# Altium project WiSN.PrjPCB
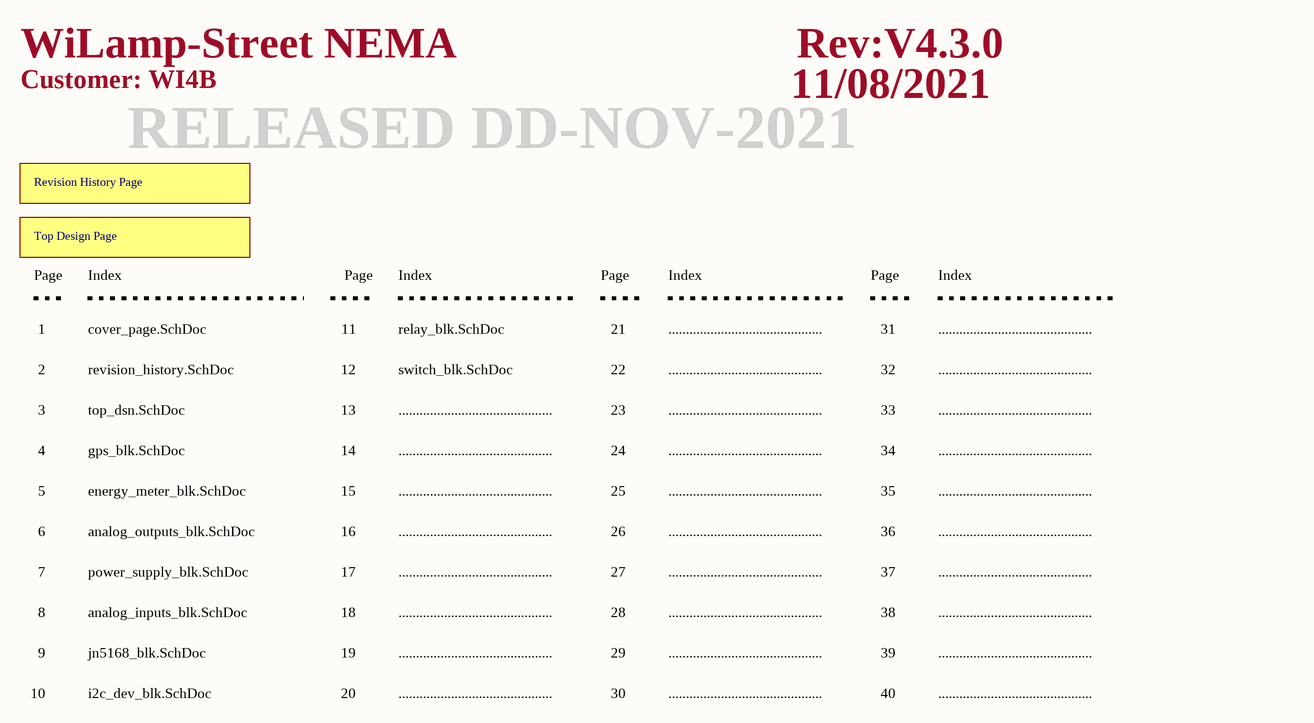
[diagram p0: cover_page.SchDoc]
12 sheets, 132 parts. Net scope: hierarchical (ports join the sheet entries above them; power ports are global).
Board file: WiSN.PcbDoc
Sheets:
  cover_page.SchDoc
    Top Design Page = top_dsn.SchDoc
      Power Supply Module (4) = power_supply_blk.SchDoc
      Energy Meter Module (5) = energy_meter_blk.SchDoc
      Analog Input Module (6) = analog_inputs_blk.SchDoc
      Analog Output Module (9) = analog_outputs_blk.SchDoc
      Core Module = jn5168_blk.SchDoc
      Relay = relay_blk.SchDoc
      i2c Devices = i2c_dev_blk.SchDoc
      GPS = gps_blk.SchDoc
      switch_blk = switch_blk.SchDoc
    Revision History Page = revision_history.SchDoc

## Sheet cover_page.SchDoc
size A4; Date: 1/11/16; Engineer: JBayalas; DocumentNumber: 1; Revision: V4.3.0; SheetNumber: 1; SheetTotal: 12

### Sub-sheets
Revision History Page = revision_history.SchDoc: no entries
Top Design Page = top_dsn.SchDoc: no entries

### Notes on the sheet
- WiLamp-Street NEMA
- Rev:V4.3.0
- Customer: WI4B
- 11/08/2021
- RELEASED DD-NOV-2021
- Page
- Index
- 1
- cover_page.SchDoc
- 11
- relay_blk.SchDoc
- 21
- ............................................
- 31
- 2
- 3
- revision_history.SchDoc
- top_dsn.SchDoc
- 12
- 13
- switch_blk.SchDoc
- 22
- 23
- 32
- 33
- 4
- gps_blk.SchDoc
- 14
- 24
- 34
- 5
- 6
- analog_outputs_blk.SchDoc
- energy_meter_blk.SchDoc
- 15
- 16
- 25
- 26
- 35
- 36
- 7
- 8
- power_supply_blk.SchDoc
- analog_inputs_blk.SchDoc
- 17
- 18
- 27
- 28
- 37
- 38
- 9
- jn5168_blk.SchDoc
- 19
- 29
- 39
- 10
- i2c_dev_blk.SchDoc
- 20
- 30
- 40
- Title:
- Sheet:
- Date:
- of
- Project:
- Revision:
- Engineer:
- Wi4B S.r.l

## Sheet top_dsn.SchDoc
size A4; Date: 1/11/16; Engineer: JBayalas; DocumentNumber: 3; Revision: V4.3.0; SheetNumber: 3; SheetTotal: 12
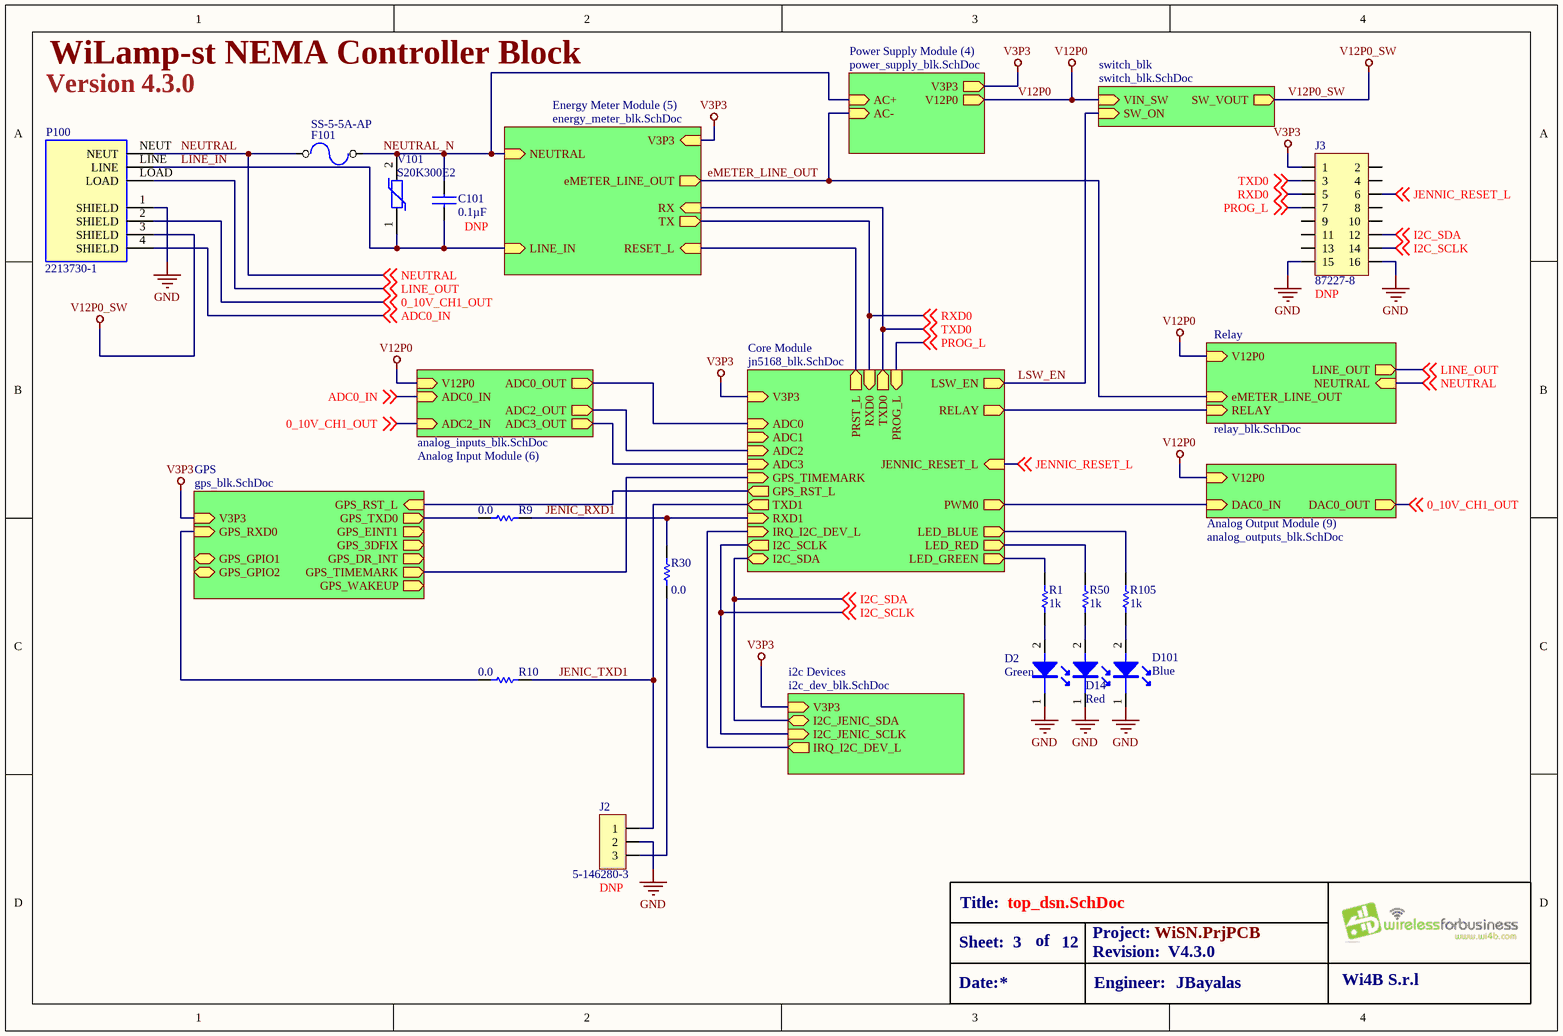
[diagram p1: top_dsn.SchDoc]

### Parts
C101  value 0.1µF  [R46KF310000P1M]  (hidden comment: R46KF310000P1M)
D2  value Green  [LED0402(GREEN)]  (hidden comment: XZVGR68W-3)
D14  value Red  [LED0402(RED)]  (hidden comment: VLMS1500-GS08)
D101  value Blue  [LED0402(BLUE)]  (hidden comment: VLMB1500-GS08)
F101  SS-5-5A-AP  [SS-5-5A-AP]
J2  5-146280-3  [5-146280-3]
J3  87227-8  [87227-8]
P100  2213730-1  [LIGHTCTRL_2213730-1_2213730-1(Primary)]
R1  value 1k  [R0402]  (hidden comment: ERJ-2RKF1001X)
R9  value 0.0  [R0603]  (hidden comment: CRCW06030000Z0EA)
R10  value 0.0  [R0603]  (hidden comment: CRCW06030000Z0EA)
R30  value 0.0  [R0603]  (hidden comment: CRCW06030000Z0EA)
R50  value 1k  [R0402]  (hidden comment: ERJ-2RKF1001X)
R105  value 1k  [R0402]  (hidden comment: ERJ-2RKF1001X)
V101  S20K300E2  [S20K300E2]

### Sub-sheets
Analog Input Module (6) = analog_inputs_blk.SchDoc: ADC0_OUT (out), ADC2_IN (in), ADC2_OUT (out), ADC0_IN (in), V12P0 (in), ADC3_OUT (out)
Analog Output Module (9) = analog_outputs_blk.SchDoc: DAC0_OUT (out), DAC0_IN (in), V12P0 (in)
Core Module = jn5168_blk.SchDoc: V3P3 (in), ADC0 (in), PROG_L (in), ADC1 (in), ADC2 (in), TXD0 (out), RXD0 (in), TXD1 (out), RXD1 (in), PWM0 (out), LED_BLUE (out), RELAY (out), PRST_L (out), I2C_SDA (bidir), I2C_SCLK (out), ADC3 (in), LED_RED (out), IRQ_I2C_DEV_L (in), LED_GREEN (out), GPS_RST_L (out), LSW_EN (out), GPS_TIMEMARK (in), JENNIC_RESET_L (in)
Energy Meter Module (5) = energy_meter_blk.SchDoc: LINE_IN (in), NEUTRAL (in), eMETER_LINE_OUT (out), TX (out), RX (in), RESET_L (in), V3P3 (in)
GPS = gps_blk.SchDoc: V3P3 (in), GPS_TXD0 (out), GPS_RXD0 (in), GPS_RST_L (in), GPS_GPIO1 (bidir), GPS_GPIO2 (bidir), GPS_EINT1 (out), GPS_3DFIX (out), GPS_DR_INT (out), GPS_TIMEMARK (out), GPS_WAKEUP (out)
i2c Devices = i2c_dev_blk.SchDoc: I2C_JENIC_SDA (bidir), I2C_JENIC_SCLK (in), V3P3 (in), IRQ_I2C_DEV_L (out)
Power Supply Module (4) = power_supply_blk.SchDoc: V12P0 (out), AC+ (in), AC- (in), V3P3 (out)
Relay = relay_blk.SchDoc: V12P0 (in), RELAY (in), eMETER_LINE_OUT (in), LINE_OUT (out), NEUTRAL (in)
switch_blk = switch_blk.SchDoc: VIN_SW (in), SW_ON (in), SW_VOUT (out)

### Nets
GND: D2.1 D14.1 D101.1 J2.2 J3.15 J3.16 P100.1(SHIELD)
LINE_IN: C101.2 P100.LINE V101.1 ; sheet Energy Meter Module (5)/LINE_IN
V3P3: J3.1 ; sheet Power Supply Module (4)/V3P3, sheet Energy Meter Module (5)/V3P3, sheet Core Module/V3P3, sheet i2c Devices/V3P3, sheet GPS/V3P3
V12P0: sheet Power Supply Module (4)/V12P0, sheet Analog Input Module (6)/V12P0, sheet Analog Output Module (9)/V12P0, sheet Relay/V12P0, sheet switch_blk/VIN_SW
V12P0_SW: P100.3(SHIELD) ; sheet switch_blk/SW_VOUT
0_10V_CH1_OUT: P100.2(SHIELD) ; off-sheet 0_10V_CH1_OUT, sheet Analog Input Module (6)/ADC2_IN, sheet Analog Output Module (9)/DAC0_OUT
ADC0_IN: P100.4(SHIELD) ; off-sheet ADC0_IN, sheet Analog Input Module (6)/ADC0_IN
eMETER_LINE_OUT: sheet Power Supply Module (4)/AC-, sheet Energy Meter Module (5)/eMETER_LINE_OUT, sheet Relay/eMETER_LINE_OUT
GPS_RST_L: sheet Core Module/GPS_RST_L, sheet GPS/GPS_RST_L
GPS_RXD0: R10.2 ; sheet GPS/GPS_RXD0
GPS_TIMEMARK: sheet Core Module/GPS_TIMEMARK, sheet GPS/GPS_TIMEMARK
GPS_TXD0: R9.2 ; sheet GPS/GPS_TXD0
I2C_SCLK: J3.14 ; off-sheet I2C_SCLK, sheet Core Module/I2C_SCLK, sheet i2c Devices/I2C_JENIC_SCLK  [project net I2C_JENIC_SCLK]
I2C_SDA: J3.12 ; off-sheet I2C_SDA, sheet Core Module/I2C_SDA, sheet i2c Devices/I2C_JENIC_SDA  [project net I2C_JENIC_SDA]
IRQ_I2C_DEV_L: sheet Core Module/IRQ_I2C_DEV_L, sheet i2c Devices/IRQ_I2C_DEV_L
JENIC_RXD1: R9.1 R30.2 ; sheet Core Module/RXD1
JENIC_TXD1: J2.1 R10.1 ; sheet Core Module/TXD1
JENNIC_RESET_L: J3.6 ; off-sheet JENNIC_RESET_L, sheet Core Module/JENNIC_RESET_L
LINE_OUT: P100.LOAD ; off-sheet LINE_OUT, sheet Relay/LINE_OUT
LSW_EN: sheet Core Module/LSW_EN, sheet switch_blk/SW_ON
NEUTRAL: F101.1 P100.NEUT ; off-sheet NEUTRAL, sheet Relay/NEUTRAL
NEUTRAL_N: C101.1 F101.2 V101.2 ; sheet Power Supply Module (4)/AC+, sheet Energy Meter Module (5)/NEUTRAL
PROG_L: J3.7 ; off-sheet PROG_L, sheet Core Module/PROG_L
RXD0: J3.5 ; off-sheet RXD0, sheet Energy Meter Module (5)/TX, sheet Core Module/RXD0
TXD0: J3.3 ; off-sheet TXD0, sheet Energy Meter Module (5)/RX, sheet Core Module/TXD0
NetC28_1: sheet Analog Input Module (6)/ADC3_OUT, sheet Core Module/ADC3
NetC601_1: sheet Analog Input Module (6)/ADC0_OUT, sheet Core Module/ADC0
NetC603_1: sheet Analog Input Module (6)/ADC2_OUT, sheet Core Module/ADC2
NetD2_2: D2.2 R1.1
NetD14_2: D14.2 R50.1
NetD101_2: D101.2 R105.1
NetJ2_3: J2.3 R30.1
NetQ4_1: sheet Core Module/RELAY, sheet Relay/RELAY
NetR1_2: R1.2 ; sheet Core Module/LED_GREEN
NetR50_2: R50.2 ; sheet Core Module/LED_RED
NetR105_2: R105.2 ; sheet Core Module/LED_BLUE
NetR108_1: sheet Analog Output Module (9)/DAC0_IN, sheet Core Module/PWM0
NetU1_2: sheet Energy Meter Module (5)/RESET_L, sheet Core Module/PRST_L

Not connected (* = marked no-connect by the designer): J3 2 4 8 9 10 11 13

### Notes on the sheet
- Version 4.3.0
- WiLamp-st NEMA Controller Block
- Title:
- Sheet:
- Date:
- of
- Project:
- Revision:
- Engineer:
- Wi4B S.r.l

### Library data of the parts
C101 = R46KF310000P1M: CAP FILM 0.1UF 20% 560VDC RADIAL; MFT: Kemet; TYPE: Through Hole; FUNCTION: Top; MPN: R46KF310000P1M; RATING: 560VDC; DNP: DNP
D2 = XZVGR68W-3: LED GREEN CLEAR 0402 SMD; MFT: SunLED; FUNCTION: Top; MPN: XZVGR68W-3; TYPE: SMD; LOAD: *; RATING: *; APN: *
D14 = VLMS1500-GS08: LED RED 0402 SMD; ALT MPN1: YLS0402/R/21/05 C; MFT: Vishay Semiconductor Opto Division; ALT MFT1: Y.Lin Elect.; FUNCTION: Top; MPN: VLMS1500-GS08; TYPE: SMD; RATING: *; LOAD: *; ALT DESC1: *
D101 = VLMB1500-GS08: LED BLUE 0402 SMD; ALT MPN1: YLS0402/B/21/05 C; MFT: Vishay Semiconductor Opto Division; ALT MFT1: Y.Lin Elect; FUNCTION: Top; MPN: VLMB1500-GS08; TYPE: SMD; RATING: *; LOAD: *; ALT DESC1: *
F101 = SS-5-5A-AP: FUSE BOARD MOUNT 5A 250VAC RAD; MFT: Eaton Bussmann; TYPE: Through-Hole; FUNCTION: Top; VALUE: 5A; MPN: SS-5-5A-AP
J2 = 5-146280-3: CONN HEADR BRKWAY .100 3POS STR; MFT: TE Connectivity AMP Connectors; FUNCTION: Top; TYPE: TH; RATING: *; DNP: DNP; VALUE: 5-146280-3; MPN: 5-146280-3
J3 = 87227-8: CONN HEADER VERT .100 16POS 15AU; MFT: TE Connectivity AMP Connectors; FUNCTION: Top; VALUE: 87227-8; TYPE: SMD; RATING: *; DNP: DNP; MPN: 87227-8
P100 = 2213730-1: MFT: TE Connectivity; FUNCTION: Top; TYPE: TH; LOAD: *; RATING: *; VALUE: 2213730-1; MPN: 2213730-1
R1 R50 R105 = ERJ-2RKF1001X: RES SMD 1K OHM 1% 1/10W 0402; MFT: Panasonic Electronic Components; RATING: 0.1W, 1/10W; FUNCTION: Top; MPN: ERJ-2RKF1001X; TYPE: Surface Mount
R9 R10 R30 = CRCW06030000Z0EA: RES SMD 0.0OHM JUMPER 1/10W 0603; MFT: Vishay Dale; RATING: 0.1W, 1/10W; FUNCTION: Top; MPN: CRCW06030000Z0EA; DNP: *; TYPE: Surface Mount
V101 = S20K300E2: VARISTOR 470V 10KA DISC 20MM; ALT MPN1: SVR20D471KA99BH; MFT: EPCOS (TDK); ALT DESC1: 20D 470V 10KVA/5KVA 6000A(8/20us) Bulk SVR20D471KA99BH; ALT MFT1: Fenghua; FUNCTION: Top; VALUE: S20K300E2; TYPE: SMD; RATING: 470V 10KA; MPN: S20K300E2; LOAD: *; APN: *

## Sheet power_supply_blk.SchDoc
size A4; Date: 1/11/2016; Engineer: JBayalas; DocumentNumber: 7; Revision: V4.3.0; SheetNumber: 7; SheetTotal: 12
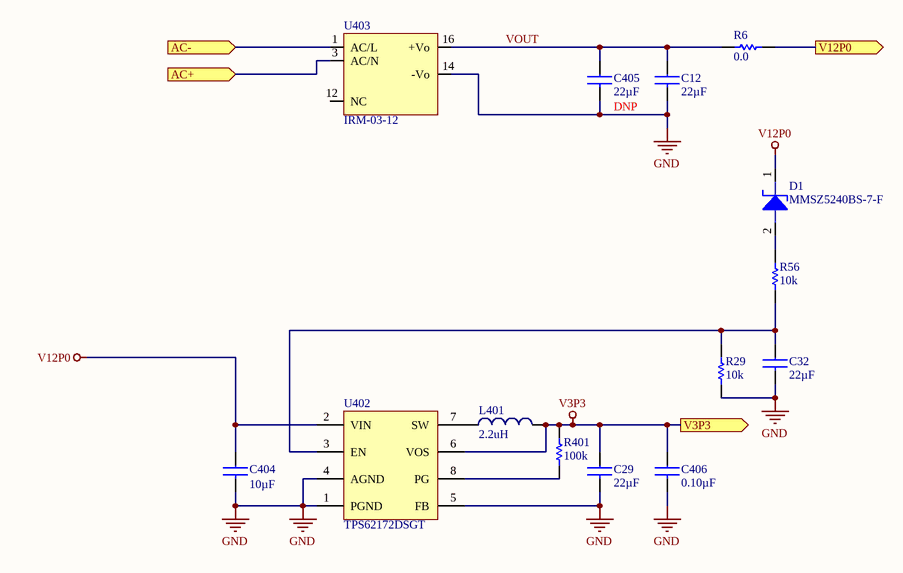
[diagram p2: power_supply_blk.SchDoc]

### Parts
C12  value 22µF  [C0805]  (hidden comment: GRM219R61C226ME15L)
C29  value 22µF  [C0805]  (hidden comment: GRM21BR61C226ME44L)
C32  value 22µF  [C0805]  (hidden comment: GRM219R61C226ME15L)
C404  value 10µF  [C1206]  (hidden comment: GRM31CR71C106KAC7L)
C405  value 22µF  [C0805]  (hidden comment: GRM21BR61C226ME44L)
C406  value 0.10µF  [C0402]  (hidden comment: GRM155R71H104ME14D)
D1  MMSZ5240BS-7-F  [SOD-323]
L401  value 2.2uH  [NR3015]  (hidden comment: NR3015T2R2M)
R6  value 0.0  [R0805]  (hidden comment: 9C08052A0R00JLHFT)
R29  value 10k  [R0603]  (hidden comment: 5-1879337-9)
R56  value 10k  [R0603]  (hidden comment: 5-1879337-9)
R401  value 100k  [R0402]  (hidden comment: ERJ-2RKF1003X)
U402  TPS62172DSGT  [WSON8]
U403  IRM-03-12  [IRM-03-12]

### Ports
AC+ (in), AC- (in), V3P3 (out), V12P0 (out)

### Nets
GND: C12.2 C29.2 C32.2 C404.2 C405.2 C406.2 R29.2 U402.1(PGND) U402.4(AGND) U402.5(FB) U403.14(-Vo)
V3P3: C29.1 C406.1 L401.2 R401.2 U402.6(VOS) ; port V3P3
V12P0: C404.1 D1.1(K) R6.2 U402.2(VIN) ; port V12P0
eMETER_LINE_OUT: U403.1(AC/L) ; port AC-
NEUTRAL_N: U403.3(AC/N) ; port AC+
VOUT: C12.1 C405.1 R6.1 U403.16(+Vo)
NetC32_1: C32.1 R29.1 R56.2 U402.3(EN)
NetD1_2: D1.2(A) R56.1
NetL401_1: L401.1 U402.7(SW)
NetR401_1: R401.1 U402.8(PG)

Not connected (* = marked no-connect by the designer): U403 12(NC)

### Notes on the sheet
- Title:
- Sheet:
- Date:
- of
- Project:
- Revision:
- Engineer:
- Wi4B S.r.l

### Library data of the parts
C12 C32 = GRM219R61C226ME15L: CAP CER 22UF 16V 20% X5R 0805; MFT: Murata Electronics North America; TYPE: Surface Mount, MLCC; FUNCTION: Power Supply; MPN: GRM219R61C226ME15L; RATING: 16V 20% X5R
C29 C405 = GRM21BR61C226ME44L: CAP CER 22UF 16V X5R 0805; MFT: Murata Electronics North America; TYPE: SMD; FUNCTION: Power Supply; MPN: GRM21BR61C226ME44L; RATING: 16V
  C29: DNP: *
  C405: DNP: DNP
C404 = GRM31CR71C106KAC7L: CAP CER 10UF 16V X7R 1206; MFT: Murata Electronics North America; TYPE: SMD; FUNCTION: Power Supply; MPN: GRM31CR71C106KAC7L; RATING: 16V; DNP: *
C406 = GRM155R71H104ME14D: CAP CER 0.1UF 50V X7R 0402; MFT: Murata Electronics North America; TYPE: SMD; FUNCTION: Power Supply; MPN: GRM155R71H104ME14D; RATING: 50V; DNP: *
D1 = MMSZ5240BS-7-F: DIODE ZENER 10V 200MW SOD323; ALT MPN1: BZT52C10S; MFT: Diodes Incorporated; TYPE: SMD; ALT DESC1: DIODE ZENER 10V 200mW SOD323 BZT52C10S; ALT MFT1: Bytesonic; FUNCTION: Power Supply; VALUE: MMSZ5240BS-7-F; RATING: 10V; LOAD: *; MPN: MMSZ5240BS-7-F; APN: *
L401 = NR3015T2R2M: FIXED IND 2.2UH 1.5A 72 MOHM SMD; MFT: Taiyo Yuden; TYPE: Surface Mount; FUNCTION: Power Supply; MPN: NR3015T2R2M
R6 = 9C08052A0R00JLHFT: RES SMD 0.0 OHM JUMPER 1/8W 0805; MFT: Yageo; FUNCTION: Power Supply; MPN: 9C08052A0R00JLHFT; RATING: Jumper; TYPE: Surface Mount
R29 R56 = 5-1879337-9: RES SMD 10K OHM 1% 1/16W 0603; MPN: ERJ-3EKF1002V; MFT: Panasonic Electronic Components; RATING: 0.063W; FUNCTION: Power Supply; TYPE: SMD; LOAD: *
R401 = ERJ-2RKF1003X: RES SMD 100K OHM 1% 1/10W 0402; MFT: Panasonic Electronic Components; RATING: 0.1W, 1/10W; FUNCTION: Power Supply; MPN: ERJ-2RKF1003X; TYPE: Surface Mount
U402 = TPS62172DSGT: IC REG BUCK 3.3V 0.5A SYNC 8WSON; MFT: TEXAS INSTRUMENTS; FUNCTION: Power Supply; VALUE: TPS62172DSGT; TYPE: SMD; RATING: *; DNP: *; MPN: TPS62172DSGT
U403 = IRM-03-12: AC/DC Power Modules 85-305Vac 12Vout 250mA 3W PCM mnt; MFT: Mean Well; FUNCTION: Power Supply; VALUE: IRM-03-12; MPN: IRM-03-12

## Sheet energy_meter_blk.SchDoc
size A4; Date: 1/11/16; Engineer: JBayalas; DocumentNumber: 5; Revision: V4.3.0; SheetNumber: 5; SheetTotal: 12
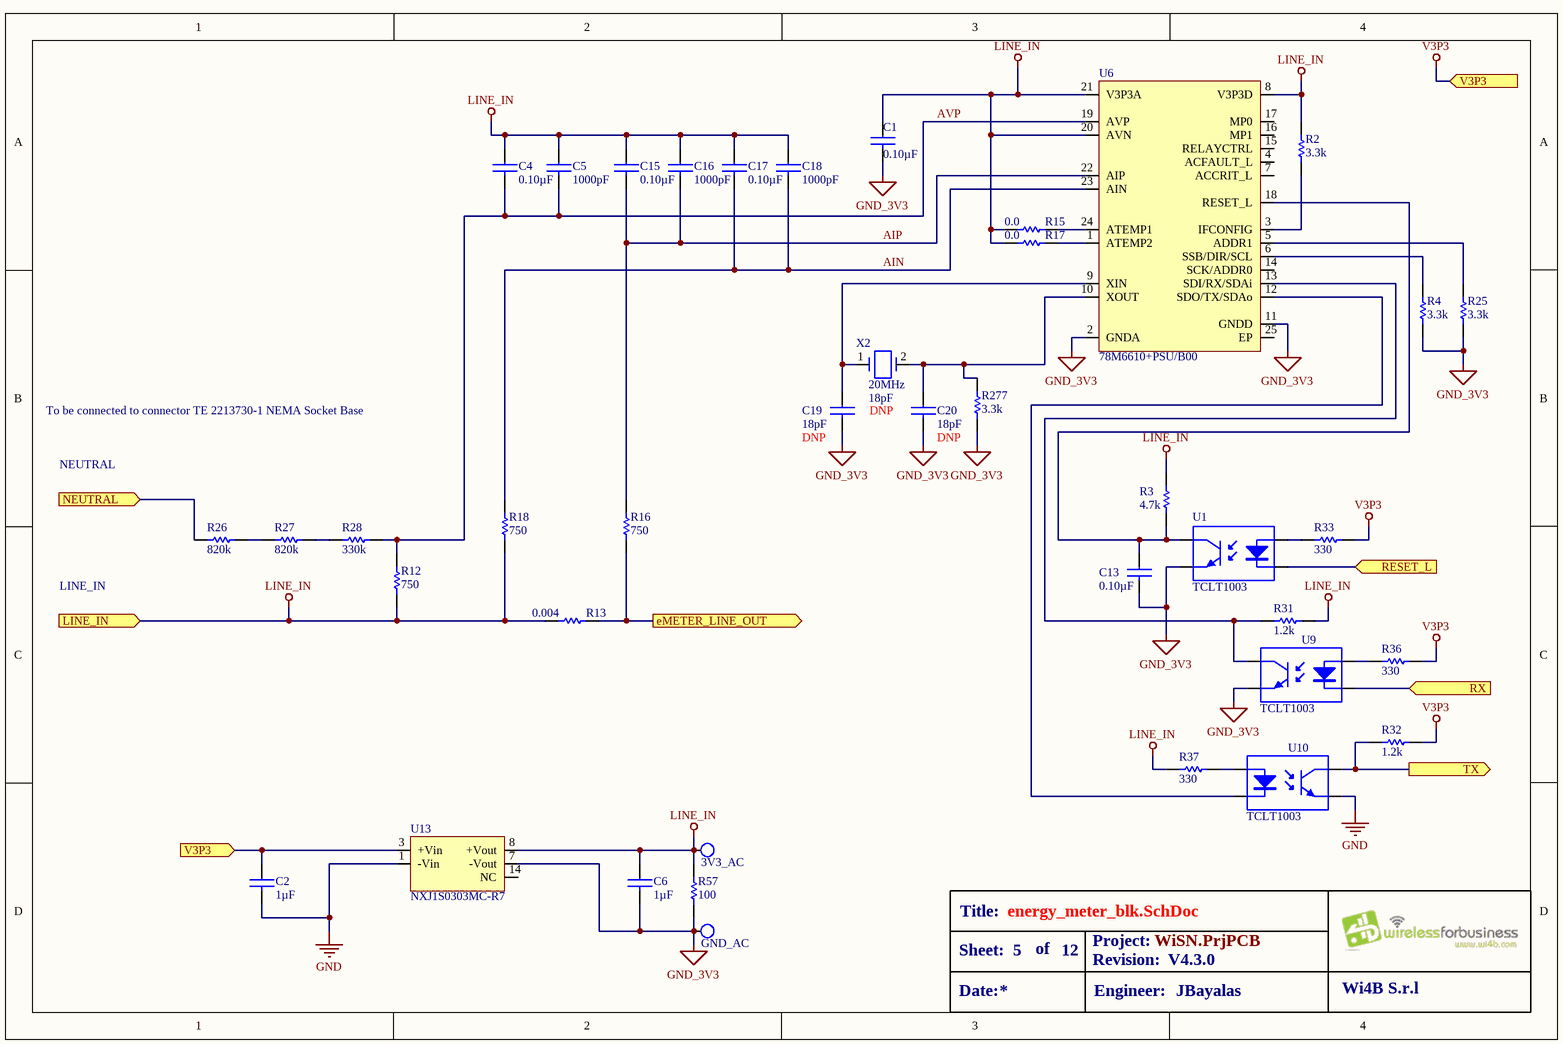
[diagram p3: energy_meter_blk.SchDoc]

### Parts
3V3_AC  TestPad TH  [TestPad TH]  (value not drawn)
C1  value 0.10µF  [C0402]  (hidden comment: GRM155R71H104ME14D)
C2  value 1µF  [C0603]  (hidden comment: GRM188R71C105KA12D)
C4  value 0.10µF  [C0402]  (hidden comment: GRM155R71H104ME14D)
C5  value 1000pF  [C0402]  (hidden comment: GRM1555C1H102JA01D)
C6  value 1µF  [C0603]  (hidden comment: GRM188R71C105KA12D)
C13  value 0.10µF  [C0402]  (hidden comment: GRM155R71H104ME14D)
C15  value 0.10µF  [C0402]  (hidden comment: GRM155R71H104ME14D)
C16  value 1000pF  [C0402]  (hidden comment: GRM1555C1H102JA01D)
C17  value 0.10µF  [C0402]  (hidden comment: GRM155R71H104ME14D)
C18  value 1000pF  [C0402]  (hidden comment: GRM1555C1H102JA01D)
C19  value 18pF  [C0402]  (hidden comment: GRM1555C1H180FA01D)
C20  value 18pF  [C0402]  (hidden comment: GRM1555C1H180FA01D)
GND_AC  TestPad TH  [TestPad TH]  (value not drawn)
R2  value 3.3k  [R0402]  (hidden comment: CRCW04023K30FKED)
R3  value 4.7k  [R0402]  (hidden comment: ERJ-2RKF4701X)
R4  value 3.3k  [R0402]  (hidden comment: CRCW04023K30FKED)
R12  value 750  [R0603]  (hidden comment: CRCW0603750RFKEA)
R13  Resistance (Ohms): 0.004  [R2512]  (hidden comment: CRE2512-FZ-R004E-3)
R15  value 0.0  [R0603]  (hidden comment: CRCW06030000Z0EA)
R16  value 750  [R0603]  (hidden comment: CRCW0603750RFKEA)
R17  value 0.0  [R0603]  (hidden comment: CRCW06030000Z0EA)
R18  value 750  [R0603]  (hidden comment: CRCW0603750RFKEA)
R25  value 3.3k  [R0402]  (hidden comment: CRCW04023K30FKED)
R26  value 820k  [R1206]  (hidden comment: CRCW1206820KFKEA)
R27  value 820k  [R1206]  (hidden comment: CRCW1206820KFKEA)
R28  value 330k  [R1206]  (hidden comment: CRCW1206330KFKEA)
R31  value 1.2k  [RESC1005X40N]  (hidden comment: RC0402FR-071K2L)
R32  value 1.2k  [RESC1005X40N]  (hidden comment: RC0402FR-071K2L)
R33  value 330  [R0402]  (hidden comment: CRCW0402330RFKED)
R36  value 330  [R0402]  (hidden comment: CRCW0402330RFKED)
R37  value 330  [R0402]  (hidden comment: CRCW0402330RFKED)
R57  value 100  [R1206]  (hidden comment: RMCF1206JT100R)
R277  value 3.3k  [R0402]  (hidden comment: CRCW04023K30FKED)
U1  TCLT1003  [SOP-4L]
U6  78M6610+PSU/B00  [QFN-24 (4X4mm)]
U9  TCLT1003  [SOP-4L]
U10  TCLT1003  [SOP-4L]
U13  NXJ1S0303MC-R7  [NXJ1S0303MC-R7]
X2  Frequency: 20MHz  Load Capacitance: 18pF  [ABLS7M (crystal)]  (hidden comment: ABLS7M-20.000MHZ-B-2-T)

### Ports
eMETER_LINE_OUT (out), LINE_IN (in), NEUTRAL (in), RESET_L (in), RX (in), TX (out), V3P3 (in)

### Nets
GND: C2.2 U10.3(A/K) U13.1(-Vin)
GND_3V3: C1.2 C6.2 C13.2 C19.2 C20.2 GND_AC.1 R4.1 R25.1 R57.2 R277.1 U1.3(A/K) U6.2(GNDA) U6.11(GNDD) U9.3(A/K) U13.7(-Vout)
LINE_IN: 3V3_AC.1 C1.1 C4.1 C5.1 C6.1 C15.1 C16.1 C17.1 C18.1 R2.2 R3.2 R12.1 R13.1 R15.1 R17.1 R18.1 R31.2 R37.1 R57.1 U6.8(V3P3D) U6.20(AVN) U6.21(V3P3A) U13.8(+Vout) ; port LINE_IN
V3P3: C2.1 R32.2 R33.2 R36.2 U13.3(+Vin) ; port V3P3
AIN: C17.2 C18.2 R18.2 U6.23(AIN)
AIP: C15.2 C16.2 R16.2 U6.22(AIP)
AVP: C4.2 C5.2 R12.2 R28.2 U6.19(AVP)
eMETER_LINE_OUT: R13.2 R16.1 ; port eMETER_LINE_OUT
NEUTRAL_N: R26.1 ; port NEUTRAL
RXD0: R32.1 U10.4(A/K) ; port TX
TXD0: U9.2(K) ; port RX
NetC13_1: C13.1 R3.1 U1.4(A/K) U6.18(RESET_L)
NetC19_1: C19.1 U6.9(XIN) X2.1
NetC20_1: C20.1 R277.2 U6.10(XOUT) X2.2
NetR2_1: R2.1 U6.3(IFCONFIG)
NetR4_2: R4.2 U6.6(SSB/DIR/SCL)
NetR15_2: R15.2 U6.24(ATEMP1)
NetR17_2: R17.2 U6.1(ATEMP2)
NetR25_2: R25.2 U6.5(ADDR1)
NetR26_2: R26.2 R27.1
NetR27_2: R27.2 R28.1
NetR31_1: R31.1 U6.13(SDI/RX/SDAi) U9.4(A/K)
NetR33_1: R33.1 U1.1(A)
NetR36_1: R36.1 U9.1(A)
NetR37_2: R37.2 U10.1(A)
NetU1_2: U1.2(K) ; port RESET_L
NetU6_12: U6.12(SDO/TX/SDAo) U10.2(K)

Not connected (* = marked no-connect by the designer): U6 4(ACFAULT_L) 7(ACCRIT_L) 14(SCK/ADDR0) 15(RELAYCTRL) 16(MP1) 17(MP0) 25(EP); U13 14(NC)

### Notes on the sheet
- To be connected to connector TE 2213730-1 NEMA Socket Base
- NEUTRAL
- LINE_IN
- Title:
- Sheet:
- Date:
- of
- Project:
- Revision:
- Engineer:
- Wi4B S.r.l

### Library data of the parts
3V3_AC GND_AC = TestPad TH: FUNCTION: Energy Meter
C1 C4 C13 C15 C17 = GRM155R71H104ME14D: CAP CER 0.1UF 50V X7R 0402; MFT: Murata Electronics North America; TYPE: SMD; FUNCTION: Energy Meter; MPN: GRM155R71H104ME14D; RATING: 50V; DNP: *
C2 C6 = GRM188R71C105KA12D: CAP CER 1UF 16V X7R 0603; MFT: Murata Electronics North America; RATING: ±10%, 16V; TYPE: Surface Mount, MLCC; FUNCTION: Energy Meter; MPN: GRM188R71C105KA12D
C5 C16 C18 = GRM1555C1H102JA01D: CAP CER 1000PF 50V NP0 0402; MFT: Murata Electronics North America; TYPE: SMD; FUNCTION: Energy Meter; MPN: GRM1555C1H102JA01D; RATING: 50V; DNP: *
C19 C20 = GRM1555C1H180FA01D: CAP CER 18PF 50V NP0 0402; MFT: Murata Electronics North America; TYPE: SMD; FUNCTION: Energy Meter; MPN: GRM1555C1H180FA01D; RATING: 50V; DNP: DNP
R2 R4 R25 R277 = CRCW04023K30FKED: RES SMD 3.3K OHM 1% 1/16W 0402; MFT: Vishay Dale; FUNCTION: Energy Meter; MPN: CRCW04023K30FKED; TYPE: SMD; RATING: 1/16W; DNP: *
R3 = ERJ-2RKF4701X: RES SMD 4.7K OHM 1% 1/10W 0402; MFT: Panasonic Electronic Components; RATING: 0.1W, 1/10W; FUNCTION: Energy Meter; MPN: ERJ-2RKF4701X; TYPE: Surface Mount
R12 R16 R18 = CRCW0603750RFKEA: RES SMD 750 OHM 1% 1/10W 0603; MFT: Vishay Dale; FUNCTION: Energy Meter; MPN: CRCW0603750RFKEA; TYPE: SMD; RATING: 1/10W; DNP: *
R13 = CRE2512-FZ-R004E-3: RES SMD 0.004 OHM 1% 3W 2512; Manufacturer: Bourns Inc.; Temperature Coefficient: ±75ppm/°C; FUNCTION: Energy Meter; Supplier 1: Digi-Key; Manufacturer Part Number: CRE2512-FZ-R004E-3; RoHS: RoHS Compliant; Category: Resistors; Stock 1: 0; Pricing 1: 1=0.62, 10=0.52, 25=0.4456, 50=0.401, 100=0.349, 250=0.31184, 500=0.25246, 1000=0.20419 (USD); Packaging: Cut Tape (CT); Tolerance: ±1%; Power (Watts): 3W; Composition: Metal Film; Features: Current Sense, Moisture Resistant; Operating Temperature: -55°C ~ 170°C; Package / Case: 2512 (6432 Metric); Supplier Device Package: 2512; Size / Dimension: 0.254" L x 0.132" W (6.45mm x 3.35mm); Height: 0.035" (0.90mm); Number of Terminations: 2; ComponentLink1URL: http://www.bourns.com/data/global/pdfs/CRE.pdf; ComponentLink1Description: http://www.bourns.com/data/global/pdfs/CRE.pdf; Supplier Part Number 1: CRE2512-FZ-R004E-3CT-ND
R15 R17 = CRCW06030000Z0EA: RES SMD 0.0OHM JUMPER 1/10W 0603; MFT: Vishay Dale; RATING: 0.1W, 1/10W; FUNCTION: Energy Meter; MPN: CRCW06030000Z0EA; TYPE: Surface Mount
R26 R27 = CRCW1206820KFKEA: RES SMD 820K OHM 1% 1/4W 1206; MFT: Vishay Dale; FUNCTION: Energy Meter; MPN: CRCW1206820KFKEA; TYPE: SMD; RATING: 1/4W; DNP: *
R28 = CRCW1206330KFKEA: RES SMD 330K OHM 1% 1/4W 1206; MFT: Vishay Dale; FUNCTION: Energy Meter; MPN: CRCW1206330KFKEA; TYPE: SMD; RATING: 1/4W; DNP: *
R31 R32 = RC0402FR-071K2L: RES SMD 1.2K OHM 1% 1/16W 0402; MFT: Yageo; APN: RQ-0122-R7-C; FUNCTION: Energy Meter; MPN: RC0402FR-071K2L; TYPE: SMD; RATING: 1/16W; LOAD: *
R33 R36 R37 = CRCW0402330RFKED: RES SMD 330 OHM 1% 1/16W 0402; MFT: Vishay Dale; FUNCTION: Energy Meter; MPN: CRCW0402330RFKED; TYPE: SMD; RATING: 1/16W; DNP: *
R57 = RMCF1206JT100R: RES 100 OHM 5% 1/4W 1206; MFT: Stackpole Electronics; FUNCTION: Energy Meter; MPN: RMCF1206JT100R; LOAD: *; RATING: 1/4W; TYPE: SMD
U1 U9 U10 = TCLT1003: OPTOISOLATR 5KV TRANSISTOR 4-SOP; ALT MPN1: LTV1003-TP-V-G; MFT: Vishay Semiconductor Opto Division; ALT DESC1: Photocoupler; ALT MFT1: LITEON; FUNCTION: Energy Meter; VALUE: TCLT1003; TYPE: SMD; RATING: 5KV; MPN: TCLT1003; LOAD: *
U6 = 78M6610+PSU/B00: IC ENERGY MEASURMENT 1PH 24TQFN; Manufacturer: Maxim Integrated; Input Impedance: 30 kOhm ~ 90 kOhm; Voltage - I/O High: 0.6V, 2V; Voltage - I/O Low: 0.5V, 0.8V; Current - Supply: 8.1mA; Voltage - Supply: 3 V ~ 3.6 V; Meter Type: Single Phase; FUNCTION: Energy Meter; Supplier 1: Digi-Key; RoHS: RoHS non-compliant; Category: Integrated Circuits (ICs); Stock 1: 62; Pricing 1: 1=2.56, 10=2.432, 25=2.3, 50=2.185, 100=2.15, 250=2.04248, 1000=1.93392 (USD); Packaging: Tube; Measurement Error: -; Operating Temperature: -40°C ~ 85°C; Mounting Type: Surface Mount; Package / Case: 24-WFQFN Exposed Pad; Supplier Device Package: 24-TQFN (4x4); ComponentLink1URL: http://datasheets.maximintegrated.com/en/ds/78M6610+PSU.pdf; ComponentLink1Description: http://datasheets.maximintegrated.com/en/ds/78M6610+PSU.pdf; Supplier Part Number 1: 78M6610+PSU/B00-ND; Manufacturer Part Number: 78M6610+PSU/B00
U13 = NXJ1S0303MC-R7: Isolated DC/DC Converters 1W 3.3Vin 3.3Vout 333mA SM; ALT MPN1: NXE1S0303MC-R7; ALT MPN2: F0303XT-1WR2; MFT: Murata Power Solutions; ALT DESC1: DC DC CONVERTER 3.3V 1W; ALT DESC2: 1W isolated DC-DC converter, Fixed input voltage, unregulated single output; ALT MFT1: Murata Power Solutions Inc.; ALT MFT2: Mornsun; FUNCTION: Energy Meter; TYPE: SMD/SMT; VALUE: NXJ1S0303MC-R7; MPN: NXJ1S0303MC-R7
X2 = ABLS7M-20.000MHZ-B-2-T: CRYSTAL 20.000 MHZ 18PF SMT; Manufacturer: Abracon LLC; Frequency Stability: ±50ppm; Frequency Tolerance: ±20ppm; ESR (Equivalent Series Resistance): 40 Ohm; Operating Mode: Fundamental; FUNCTION: Energy Meter; Supplier 1: Digi-Key; Manufacturer Part Number: ABLS7M-20.000MHZ-B-2-T; RoHS: RoHS Compliant; Category: Crystals and Oscillators; Stock 1: 0; Pricing 1: 3000=0.1725 (USD); Packaging: Tape & Reel (TR); Type: MHz Crystal; Operating Temperature: -20°C ~ 70°C; Ratings: -; Mounting Type: Surface Mount; Package / Case: 2-SMD; Size / Dimension: 0.450" L x 0.190" W (11.40mm x 4.70mm); Height: 0.165" (4.20mm); ComponentLink1URL: http://abracon.com/Resonators/ABLS7M.pdf; ComponentLink1Description: http://abracon.com/Resonators/ABLS7M.pdf; Supplier Part Number 1: ABLS7M-20.000MHZ-B-2-T-ND; DNP: DNP

## Sheet analog_inputs_blk.SchDoc
size A4; Date: 1/11/2016; Engineer: JBayalas; DocumentNumber: 8; Revision: V4.3.0; SheetNumber: 8; SheetTotal: 12
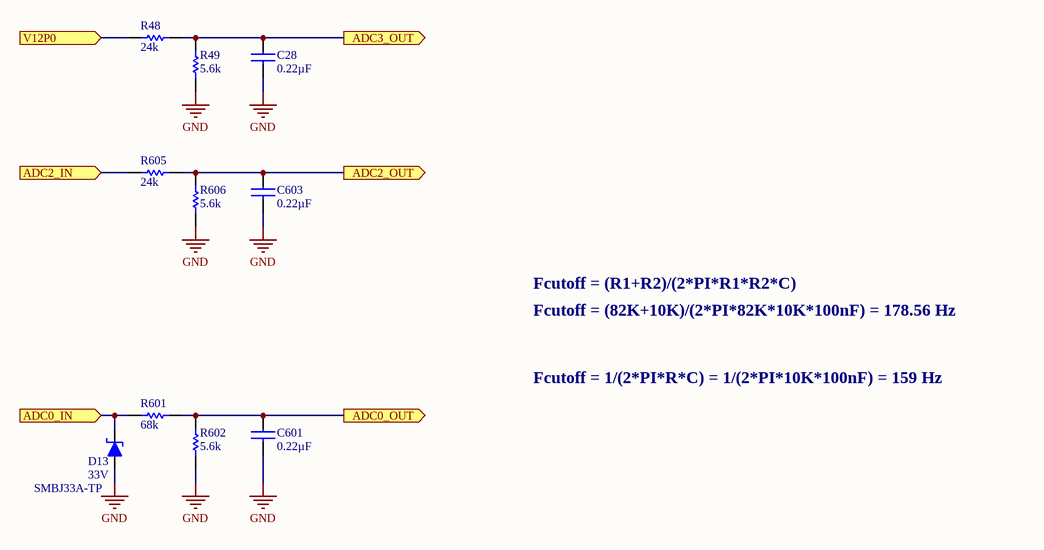
[diagram p4: analog_inputs_blk.SchDoc]

### Parts
C28  value 0.22µF  [C0603]  (hidden comment: GCM188R71H224KA64D)
C601  value 0.22µF  [C0603]  (hidden comment: GCM188R71H224KA64D)
C603  value 0.22µF  [C0603]  (hidden comment: GCM188R71H224KA64D)
D13  RATING: 33V  [DO-214AA, SMB]  (hidden comment: SMBJ33A-TP)
R48  value 24k  [R0603]  (hidden comment: TNPW060324K0BEEA)
R49  value 5.6k  [R0603]  (hidden comment: ERA-3AEB562V)
R601  value 68k  [R0603]  (hidden comment: ERA-3AEB683V)
R602  value 5.6k  [R0603]  (hidden comment: ERA-3AEB562V)
R605  value 24k  [R0603]  (hidden comment: TNPW060324K0BEEA)
R606  value 5.6k  [R0603]  (hidden comment: ERA-3AEB562V)

### Ports
ADC0_IN (in), ADC0_OUT (out), ADC2_IN (in), ADC2_OUT (out), ADC3_OUT (out), V12P0 (in)

### Nets
GND: C28.2 C601.2 C603.2 D13.2(A) R49.1 R602.1 R606.1
V12P0: R48.1 ; port V12P0
0_10V_CH1_OUT: R605.1 ; port ADC2_IN
ADC0_IN: D13.1(K) R601.1 ; port ADC0_IN
NetC28_1: C28.1 R48.2 R49.2 ; port ADC3_OUT
NetC601_1: C601.1 R601.2 R602.2 ; port ADC0_OUT
NetC603_1: C603.1 R605.2 R606.2 ; port ADC2_OUT

### Notes on the sheet
- Fcutoff = (R1+R2)/(2*PI*R1*R2*C)
- Fcutoff = (82K+10K)/(2*PI*82K*10K*100nF) = 178.56 Hz
- Fcutoff = 1/(2*PI*R*C) = 1/(2*PI*10K*100nF) = 159 Hz
- Title:
- Sheet:
- Date:
- of
- Project:
- Revision:
- Engineer:
- Wi4B S.r.l

### Library data of the parts
C28 C601 C603 = GCM188R71H224KA64D: CAP CER 0.22UF 50V X7R 0603; MFT: Murata Electronics North America; TYPE: Surface Mount, MLCC; FUNCTION: Analog Inputs; MPN: GCM188R71H224KA64D; RATING: 50V
D13 = SMBJ33A-TP: TVS DIODE 33VWM 53.3VC SMB; MFT: Micro Commercial Co; TYPE: Surface Mount; FUNCTION: Analog Inputs; VALUE: SMBJ33A-TP; MPN: SMBJ33A-TP
R48 = TNPW060324K0BEEA: RES 24K OHM 0.1% 1/8W 0603; MFT: Vishay Dale; FUNCTION: Analog Inputs; MPN: TNPW060324K0BEEA; TYPE: SMD; RATING: 1/8W; DNP: *
R49 R602 R606 = ERA-3AEB562V: RES SMD 5.6K OHM 0.1% 1/10W 0603; MFT: Panasonic Electronic Components; FUNCTION: Analog Inputs; MPN: ERA-3AEB562V; TYPE: SMD; RATING: 1/10W; DNP: *
R601 = ERA-3AEB683V: RES SMD 68K OHM 0.1% 1/10W 0603; MFT: Panasonic Electronic Components; FUNCTION: Analog Inputs; MPN: ERA-3AEB683V; TYPE: SMD; RATING: 1/10W; DNP: *
R605 = TNPW060324K0BEEA: RES SMD 24K OHM 0.1% 1/8W 0603; MFT: Vishay Dale; FUNCTION: Analog Inputs; MPN: TNPW060324K0BEEA; TYPE: SMD; RATING: 1/8W; DNP: *

## Sheet analog_outputs_blk.SchDoc
size A4; Engineer: JBayalas; DocumentNumber: 6; Revision: V4.3.0; SheetNumber: 6; SheetTotal: 12
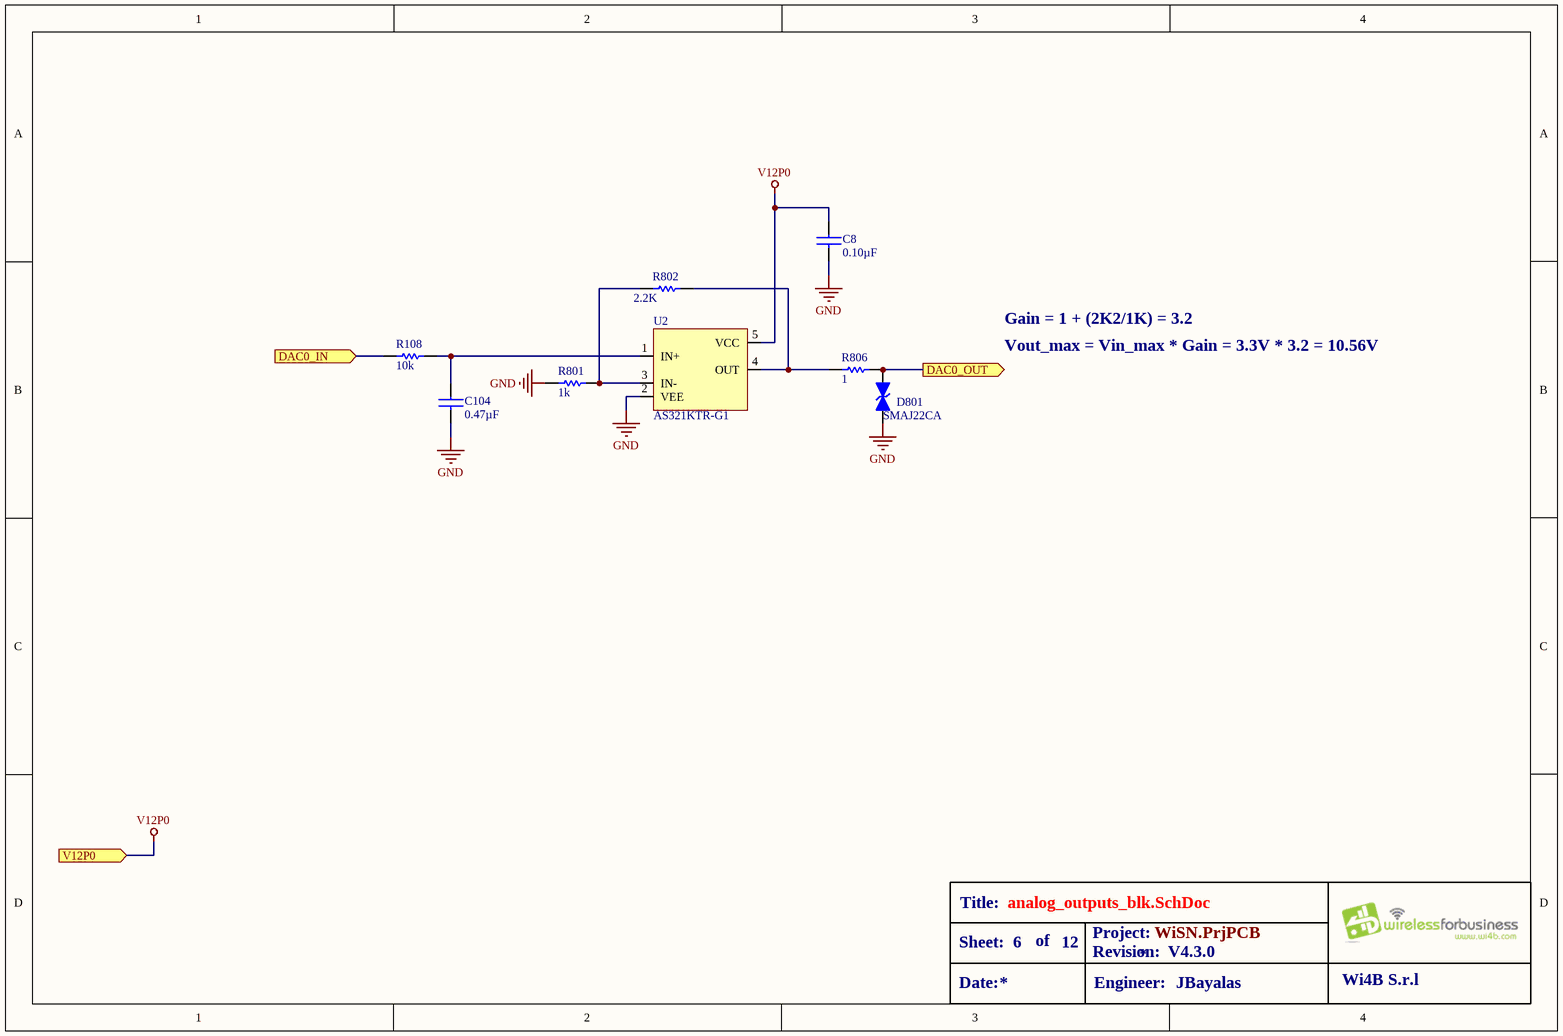
[diagram p5: analog_outputs_blk.SchDoc]

### Parts
C8  value 0.10µF  [C0402]  (hidden comment: GRM155R71H104ME14D)
C104  value 0.47µF  [C0603]  (hidden comment: GRM188R71C474KA88D)
D801  SMAJ22CA  [DO-214AC]
R108  value 10k  [R0402]  (hidden comment: ERJ-2RKF1002X)
R801  value 1k  [R0402]  (hidden comment: ERJ-2RKF1001X)
R802  value 2.2K  [R0603]  (hidden comment: CRCW06032K20FKEA)
R806  value 1  [R0402]  (hidden comment: CRCW04021R00FKED)
U2  AS321KTR-G1  [SOT-23-5]

### Ports
DAC0_IN (in), DAC0_OUT (out), V12P0 (in)

### Nets
GND: C8.2 C104.2 D801.2(K) R801.1 U2.2(VEE)
V12P0: C8.1 U2.5(VCC) ; port V12P0
0_10V_CH1_OUT: D801.1(A) R806.2 ; port DAC0_OUT
NetC104_1: C104.1 R108.2 U2.1(IN+)
NetR108_1: R108.1 ; port DAC0_IN
NetR801_2: R801.2 R802.1 U2.3(IN-)
NetR802_2: R802.2 R806.1 U2.4(OUT)

### Notes on the sheet
- Gain = 1 + (2K2/1K) = 3.2
- Vout_max = Vin_max * Gain = 3.3V * 3.2 = 10.56V
- Title:
- Sheet:
- Date:
- of
- Project:
- Revision:
- Engineer:
- Wi4B S.r.l

### Library data of the parts
C8 = GRM155R71H104ME14D: CAP CER 0.1UF 50V X7R 0402; MFT: Murata Electronics North America; TYPE: SMD; FUNCTION: analog outputs; MPN: GRM155R71H104ME14D; RATING: 50V; DNP: *; Parameter 1: *
C104 = GRM188R71C474KA88D: CAP CER 0.47UF 16V X7R 0603; MFT: Murata Electronics North America; TYPE: SMD; FUNCTION: analog outputs; MPN: GRM188R71C474KA88D; RATING: 16V; DNP: *
D801 = SMAJ22CA: TVS Diodes - Transient Voltage Suppressors 22Vr 400W 11.3A 5% BiDirectional; MFT: Littelfuse; TYPE: SMD/SMT; RATING: 22 V; ALT MFT: Bytesonic; FUNCTION: analog outputs; VALUE: SMAJ22CA; MPN: SMAJ22CA; ALT DESC: *; ALT MPN: SMAJ22CA
R108 = ERJ-2RKF1002X: RES SMD 10K OHM 1% 1/10W 0402; MFT: Panasonic Electronic Components; RATING: 0.1W, 1/10W; FUNCTION: analog outputs; MPN: ERJ-2RKF1002X; TYPE: Surface Mount
R801 = ERJ-2RKF1001X: RES SMD 1K OHM 1% 1/10W 0402; MFT: Panasonic Electronic Components; RATING: 0.1W, 1/10W; FUNCTION: analog outputs; MPN: ERJ-2RKF1001X; TYPE: Surface Mount
R802 = CRCW06032K20FKEA: RES SMD 2.2K OHM 1% 1/10W 0603; MFT: Vishay Dale; FUNCTION: analog outputs; MPN: CRCW06032K20FKEA; RATING: *; LOAD: *; TYPE: SMD
R806 = CRCW04021R00FKED: RES SMD 1 OHM 1% 1/16W 0402; MFT: Vishay Dale; FUNCTION: analog outputs; MPN: CRCW04021R00FKED; TYPE: SMD; RATING: 1/16W; DNP: *
U2 = AS321KTR-G1: IC OPAMP GP 1 CIRCUIT SOT25; MFT: Diodes Incorporated; FUNCTION: analog outputs; MPN: AS321KTR-G1; TYPE: SMD; LOAD: *; RATING: *; APN: *; VALUE: AS321KTR-G1

## Sheet jn5168_blk.SchDoc
size A4; Date: 1/11/2016; Engineer: JBayalas; DocumentNumber: 9; Revision: V4.3.0; SheetNumber: 9; SheetTotal: 12
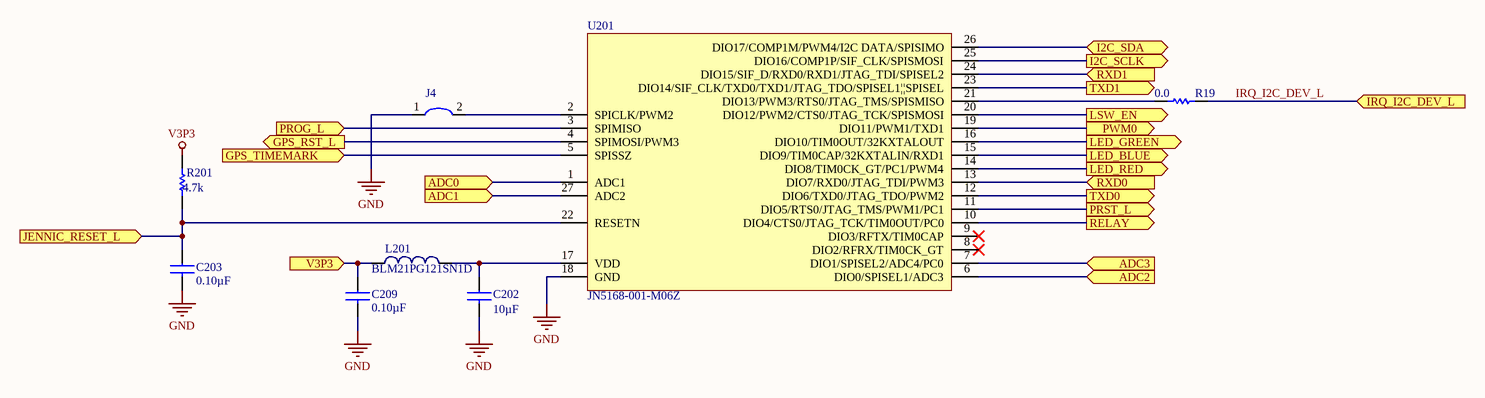
[diagram p6: jn5168_blk.SchDoc]

### Parts
C202  value 10µF  [C1206]  (hidden comment: GRM31CR71C106KAC7L)
C203  value 0.10µF  [C0402]  (hidden comment: GRM155R71H104ME14D)
C209  value 0.10µF  [C0402]  (hidden comment: GRM155R71H104ME14D)
J4  0603 Jumper  [0603 Jumper]  (value not drawn)
L201  BLM21PG121SN1D  [0805 INDUCTOR]
R19  value 0.0  [R0402]  (hidden comment: CRCW04020000Z0ED)
R201  value 4.7k  [R0402]  (hidden comment: ERJ-2RKF4701X)
U201  JN5168-001-M06Z  [JN5168-001-M06Z]

### Ports
ADC0 (in), ADC1 (in), ADC2 (in), ADC3 (in), GPS_RST_L (out), GPS_TIMEMARK (in), I2C_SCLK (out), I2C_SDA (bidir), IRQ_I2C_DEV_L (in), JENNIC_RESET_L (in), LED_BLUE (out), LED_GREEN (out), LED_RED (out), LSW_EN (out), PROG_L (in), PRST_L (out), PWM0 (out), RELAY (out), RXD0 (in), RXD1 (in), TXD0 (out), TXD1 (out), V3P3 (in)

### Nets
GND: C202.2 C203.2 C209.2 J4.1 U201.18(GND)
V3P3: C209.1 L201.2 R201.2 ; port V3P3
GPS_RST_L: U201.4(SPIMOSI/PWM3) ; port GPS_RST_L
GPS_TIMEMARK: U201.5(SPISSZ) ; port GPS_TIMEMARK
I2C_JENIC_SCLK: U201.25(DIO16/COMP1P/SIF_CLK/SPISMOSI) ; port I2C_SCLK
I2C_JENIC_SDA: U201.26(DIO17/COMP1M/PWM4/I2C_DATA/SPISIMO) ; port I2C_SDA
IRQ_I2C_DEV_L: R19.2 ; port IRQ_I2C_DEV_L
JENIC_RXD1: U201.24(DIO15/SIF_D/RXD0/RXD1/JTAG_TDI/SPISEL2) ; port RXD1
JENIC_TXD1: U201.23(DIO14/SIF_CLK/TXD0/TXD1/JTAG_TDO/SPISEL1||SPISEL) ; port TXD1
JENNIC_RESET_L: C203.1 R201.1 U201.22(RESETN) ; port JENNIC_RESET_L
LSW_EN: U201.20(DIO12/PWM2/CTS0/JTAG_TCK/SPISMOSI) ; port LSW_EN
PROG_L: U201.3(SPIMISO) ; port PROG_L
RXD0: U201.13(DIO7/RXD0/JTAG_TDI/PWM3) ; port RXD0
TXD0: U201.12(DIO6/TXD0/JTAG_TDO/PWM2) ; port TXD0
NetC28_1: U201.7(DIO1/SPISEL2/ADC4/PC0) ; port ADC3
NetC202_1: C202.1 L201.1 U201.17(VDD)
NetC601_1: U201.1(ADC1) ; port ADC0
NetC603_1: U201.6(DIO0/SPISEL1/ADC3) ; port ADC2
NetJ4_2: J4.2 U201.2(SPICLK/PWM2)
NetQ4_1: U201.10(DIO4/CTS0/JTAG_TCK/TIM0OUT/PC0) ; port RELAY
NetR1_2: U201.16(DIO10/TIM0OUT/32KXTALOUT) ; port LED_GREEN
NetR19_1: R19.1 U201.21(DIO13/PWM3/RTS0/JTAG_TMS/SPISMISO)
NetR50_2: U201.14(DIO8/TIM0CK_GT/PC1/PWM4) ; port LED_RED
NetR105_2: U201.15(DIO9/TIM0CAP/32KXTALIN/RXD1) ; port LED_BLUE
NetR108_1: U201.19(DIO11/PWM1/TXD1) ; port PWM0
NetU1_2: U201.11(DIO5/RTS0/JTAG_TMS/PWM1/PC1) ; port PRST_L
NetU201_27: U201.27(ADC2) ; port ADC1

Not connected (* = marked no-connect by the designer): U201 8(DIO2/RFRX/TIM0CK_GT)* 9(DIO3/RFTX/TIM0CAP)*

### Notes on the sheet
- Title:
- Sheet:
- Date:
- of
- Project:
- Revision:
- Engineer:
- Wi4B S.r.l

### Library data of the parts
C202 = GRM31CR71C106KAC7L: CAP CER 10UF 16V X7R 1206; MFT: Murata Electronics North America; TYPE: SMD; FUNCTION: Jennic; MPN: GRM31CR71C106KAC7L; RATING: 16V; DNP: *
C203 C209 = GRM155R71H104ME14D: CAP CER 0.1UF 50V X7R 0402; MFT: Murata Electronics North America; TYPE: SMD; FUNCTION: Jennic; MPN: GRM155R71H104ME14D; RATING: 50V; DNP: *
J4 = 0603 Jumper: FUNCTION: Jennic
L201 = BLM21PG121SN1D: FERRITE CHIP 120 OHM 0805; MFT: Murata Electronics North America; RATING: 3A; TYPE: Surface Mount; VALUE: 120 Ohm; FUNCTION: Jennic; MPN: BLM21PG121SN1D
R19 = CRCW04020000Z0ED: RES SMD 0.0OHM JUMPER 1/16W 0402; MFT: Vishay Dale; RATING: 63mW; FUNCTION: Jennic; MPN: CRCW04020000Z0ED; LOAD: *; TYPE: Surface Mount
R201 = ERJ-2RKF4701X: RES SMD 4.7K OHM 1% 1/10W 0402; MFT: Panasonic Electronic Components; RATING: 0.1W, 1/10W; FUNCTION: Jennic; MPN: ERJ-2RKF4701X; TYPE: Surface Mount
U201 = JN5168-001-M06Z: RF TXRX MODULE 802.15.4 U.FL ANT; MFT: NXP USA Inc.; FUNCTION: Jennic; VALUE: JN5168-001-M06Z; TYPE: SMD; RATING: *; DNP: *; MPN: JN5168-001-M06Z

## Sheet relay_blk.SchDoc
size A4; Engineer: JBayalas; DocumentNumber: 11; Revision: V4.3.0; SheetNumber: 11; SheetTotal: 12
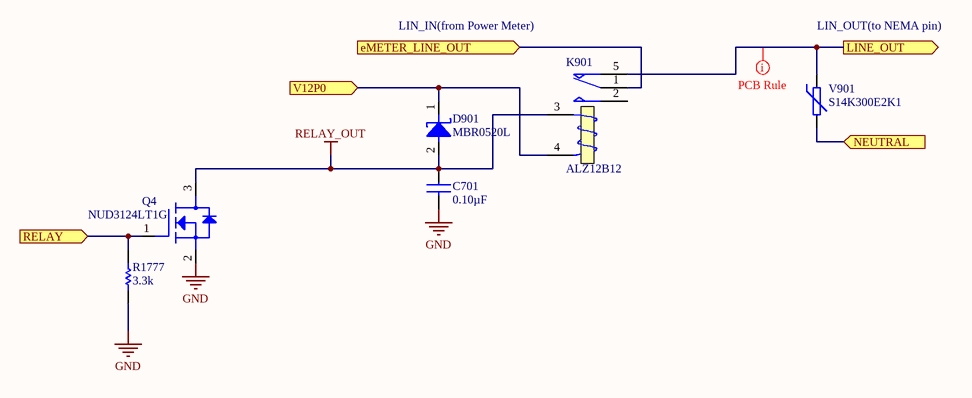
[diagram p7: relay_blk.SchDoc]

### Parts
C701  value 0.10µF  [C0402]  (hidden comment: GRM155R71H104ME14D)
D901  MBR0520L  [SOD123]
K901  ALZ12B12  [ALZ12B12 (custom)]
Q4  NUD3124LT1G  [SOT-23-3]
R1777  value 3.3k  [R0402]  (hidden comment: CRCW04023K30FKED)
V901  S14K300E2K1  [S14K300E2K1]

### Ports
eMETER_LINE_OUT (in), LINE_OUT (out), NEUTRAL (in), RELAY (in), V12P0 (in)

### Nets
GND: C701.2 Q4.2(source) R1777.1
RELAY_OUT: C701.1 D901.2(anode) K901.3(T1) Q4.3(drain)
V12P0: D901.1(cathode) K901.4(T2) ; port V12P0
eMETER_LINE_OUT: K901.1(COM) ; port eMETER_LINE_OUT
LINE_OUT: K901.5(NC) V901.2 ; port LINE_OUT
NEUTRAL: V901.1 ; port NEUTRAL
NetQ4_1: Q4.1(gate) R1777.2 ; port RELAY

Not connected (* = marked no-connect by the designer): K901 2(NO)

### Layout directives
rule Clearance Constraint [Clearance = 1.7mm]: LINE_OUT

### Notes on the sheet
- (near K901) LIN_IN(from Power Meter)
- LIN_OUT(to NEMA pin)
- Title:
- Sheet:
- Date:
- of
- Project:
- Revision:
- Engineer:
- WI4B S.r.l

### Library data of the parts
C701 = GRM155R71H104ME14D: CAP CER 0.1UF 50V X7R 0402; MFT: Murata Electronics North America; TYPE: SMD; FUNCTION: Relay; MPN: GRM155R71H104ME14D; RATING: 50V; DNP: *
D901 = MBR0520L: DIODE SCHOTTKY 20V 0.5A SOD123; ALT MPN1: B0520W; MFT: ON Semiconductor; TYPE: SMD; RATING: 20V 500MA; ALT DESC1: DIODE SCHOTTKY 20V 0.5A SOD123 B0520W; ALT MFT1: Bytesonic; FUNCTION: Relay; MPN: MBR0520L; VALUE: MBR0520L
K901 = ALZ12B12: General Purpose Relays 16A 12VDC SPDT CLASS B; ALT MPN2: HF115F/012-1ZS3A; ALT MPN1: RZ03-1C4-D012; MFT: Panasonic Industrial Devices; ALT DESC2: Miniatrure High Power Relay HF115F/012-1ZS3A; ALT DESC1: RELAY GEN PURPOSE SPDT 16A 12V; ALT MFT2: Hongfa; ALT MFT1: TE connectivity; FUNCTION: Relay; VALUE: ALZ12B12; TYPE: Through Hole; MPN: ALZ12B12
Q4 = NUD3124LT1G: IC INDCT LOAD DRVR AUTO SOT23; MFT: ON Semiconductor; TYPE: Surface Mount; FUNCTION: Relay; VALUE: NUD3124LT1G; MPN: NUD3124LT1G
R1777 = CRCW04023K30FKED: RES SMD 3.3K OHM 1% 1/16W 0402; MFT: Vishay Dale; FUNCTION: Relay; MPN: CRCW04023K30FKED; TYPE: SMD; RATING: 1/16W; DNP: *
V901 = S14K300E2K1: VARISTOR 470V 6KA DISC 14MM; ALT MPN1: SVR14D471KA78BH; MFT: EPCOS (TDK); ALT MFT1: Fenghua Hi Tech; ALT DESC1: 14D 470V 6KVA/3KVA 6000A(8/20us) Bulk SVR14D471KA78BH; FUNCTION: Relay; VALUE: S14K300E2K1; TYPE: TH; RATING: 470V; MPN: S14K300E2K1; LOAD: *; APN: *

## Sheet i2c_dev_blk.SchDoc
size A4; Engineer: JBayalas; DocumentNumber: 10; Revision: V4.3.0; SheetNumber: 10; SheetTotal: 12
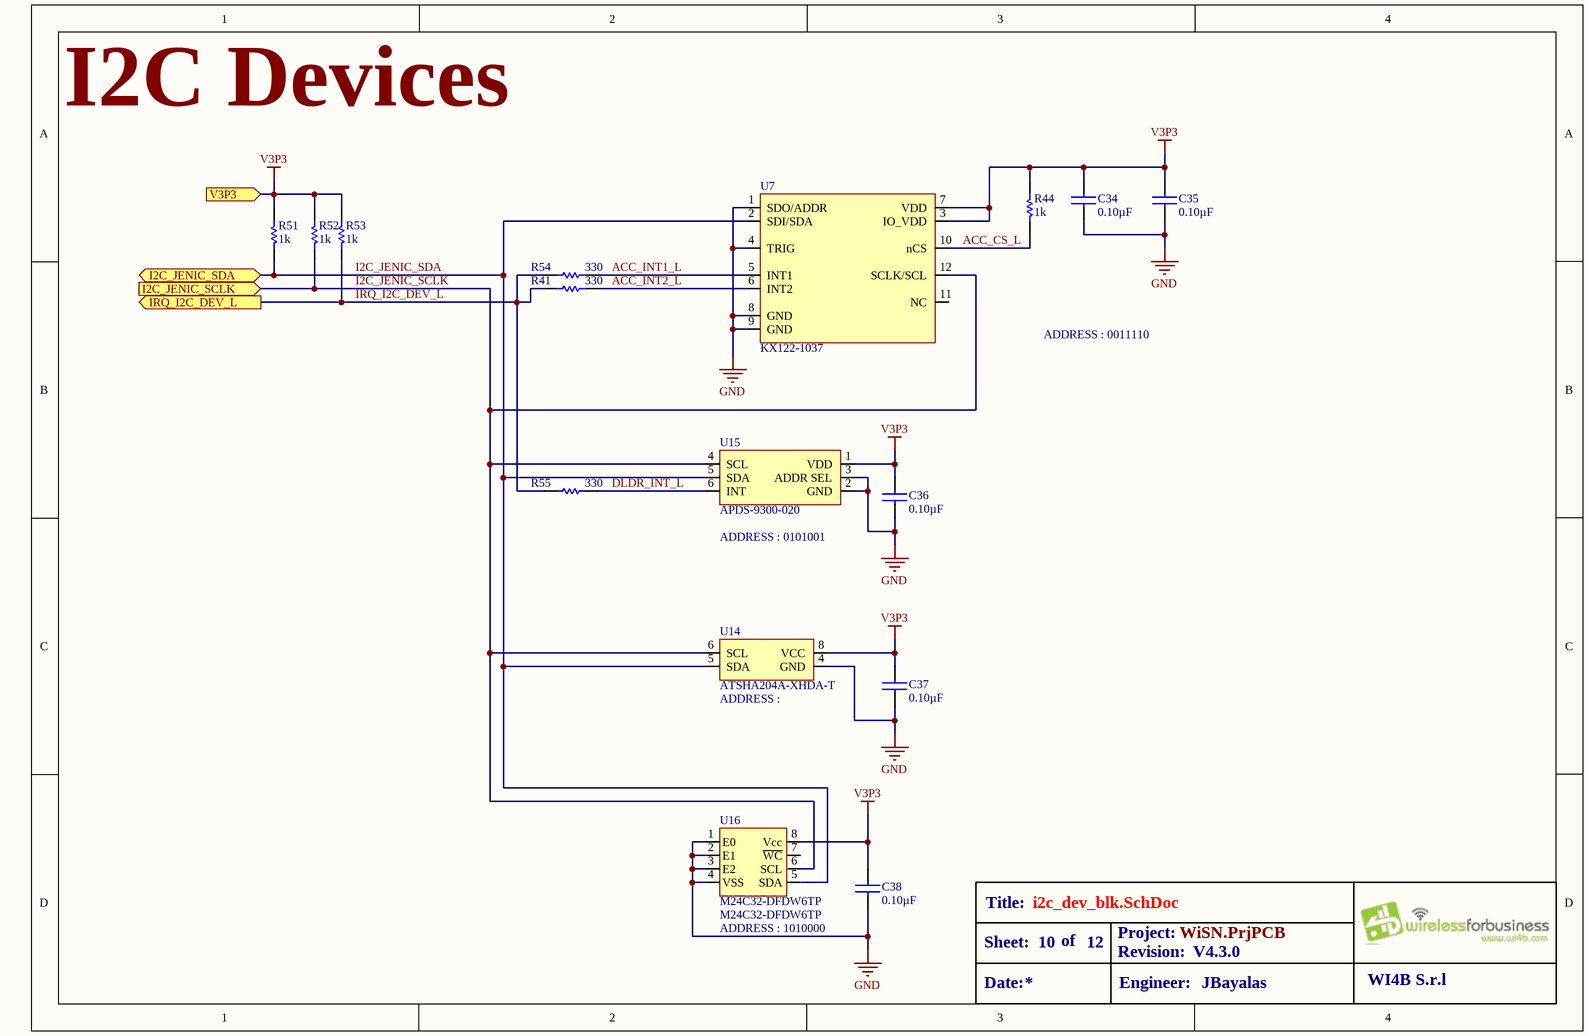
[diagram p8: i2c_dev_blk.SchDoc]

### Parts
C34  value 0.10µF  [C0402]  (hidden comment: GRM155R71H104ME14D)
C35  value 0.10µF  [C0402]  (hidden comment: GRM155R71H104ME14D)
C36  value 0.10µF  [C0402]  (hidden comment: GRM155R71H104ME14D)
C37  value 0.10µF  [C0402]  (hidden comment: GRM155R71H104ME14D)
C38  value 0.10µF  [C0402]  (hidden comment: GRM155R71H104ME14D)
R41  value 330  [R0402]  (hidden comment: CRCW0402330RFKED)
R44  value 1k  [R0402]  (hidden comment: MCS04020C1001FE000)
R51  value 1k  [R0402]  (hidden comment: MCS04020C1001FE000)
R52  value 1k  [R0402]  (hidden comment: MCS04020C1001FE000)
R53  value 1k  [R0402]  (hidden comment: MCS04020C1001FE000)
R54  value 330  [R0402]  (hidden comment: CRCW0402330RFKED)
R55  value 330  [R0402]  (hidden comment: CRCW0402330RFKED)
U7  KX122-1037  [KX122-1037]
U14  ATSHA204A-XHDA-T  [TSSOP-8 (wide Body)]
U15  APDS-9300-020  [APDS-9300-020]
U16  M24C32-DFDW6TP  [8-TSSOP]

### Ports
I2C_JENIC_SCLK (in), I2C_JENIC_SDA (bidir), IRQ_I2C_DEV_L (out), V3P3 (in)

### Nets
GND: C34.2 C35.2 C36.2 C37.2 C38.2 U7.1(SDO/ADDR) U7.4(TRIG) U7.8(GND) U7.9(GND) U14.4(GND) U15.2(GND) U15.3(ADDR_SEL) U16.1(E0) U16.2(E1) U16.3(E2) U16.4(VSS)
V3P3: C34.1 C35.1 C36.1 C37.1 C38.1 R44.2 R51.2 R52.2 R53.2 U7.3(IO_VDD) U7.7(VDD) U14.8(VCC) U15.1(VDD) U16.8(Vcc) ; port V3P3
ACC_CS_L: R44.1 U7.10(nCS)
ACC_INT1_L: R54.1 U7.5(INT1)
ACC_INT2_L: R41.1 U7.6(INT2)
DLDR_INT_L: R55.1 U15.6(INT)
I2C_JENIC_SCLK: R52.1 U7.12(SCLK/SCL) U14.6(SCL) U15.4(SCL) U16.6(SCL) ; port I2C_JENIC_SCLK
I2C_JENIC_SDA: R51.1 U7.2(SDI/SDA) U14.5(SDA) U15.5(SDA) U16.5(SDA) ; port I2C_JENIC_SDA
IRQ_I2C_DEV_L: R41.2 R53.1 R54.2 R55.2 ; port IRQ_I2C_DEV_L

Not connected (* = marked no-connect by the designer): U7 11(NC); U16 7(~{WC})

### Notes on the sheet
- I2C Devices
- ADDRESS : 0011110
- (near U15) ADDRESS : 0101001
- (near U14) ADDRESS :
- ADDRESS : 1010000
- Title:
- Sheet:
- Date:
- of
- Project:
- Revision:
- Engineer:
- WI4B S.r.l

### Library data of the parts
C34-C38 = GRM155R71H104ME14D: CAP CER 0.1UF 50V X7R 0402; MFT: Murata Electronics North America; TYPE: SMD; FUNCTION: I2C Devices; MPN: GRM155R71H104ME14D; RATING: 50V; DNP: *
R41 R54 R55 = CRCW0402330RFKED: RES SMD 330 OHM 1% 1/16W 0402; MFT: Vishay Dale; FUNCTION: I2C Devices; MPN: CRCW0402330RFKED; TYPE: SMD; RATING: 1/16W; DNP: *
R44 R51-R53 = MCS04020C1001FE000: RES SMD 1K OHM 1% 1/10W 0402; MFT: Vishay Beyschlag; FUNCTION: I2C Devices; MPN: MCS04020C1001FE000; TYPE: SMD; RATING: 1/10W; DNP: *
U7 = KX122-1037: ACCELEROMETER 2-8G I2C/SPI 12LGA; MFT: Kionix Inc.; FUNCTION: I2C Devices; LOAD: *; RATING: *; TYPE: SMD; VALUE: KX122-1037; MPN: KX122-1037
U14 = ATSHA204A-XHDA-T: IC AUTHENTICATION CHIP 8TSSOP; MFT: Microchip Technology; FUNCTION: I2C Devices; LOAD: *; TYPE: SMD; RATING: *; VALUE: ATSHA204A-XHDA-T; MPN: ATSHA204A-XHDA-T
U15 = APDS-9300-020: IC SENSOR AMBIENT LIGHT 6CHIPLED; MFT: Broadcom Limited; FUNCTION: I2C Devices; LOAD: *; TYPE: SMD; RATING: *; VALUE: APDS-9300-020; MPN: APDS-9300-020
U16 = M24C32-DFDW6TP: IC EEPROM 32KBIT 400KHZ 8TSSOP; MFT: STMicroelectronics; FUNCTION: I2C Devices; TYPE: SMD; VALUE: M24C32-DFDW6TP; RATING: *; LOAD: *; MPN: M24C32-DFDW6TP

## Sheet gps_blk.SchDoc
size A4; Engineer: JBayalas; DocumentNumber: 4; Revision: V4.3.0; SheetNumber: 4; SheetTotal: 12
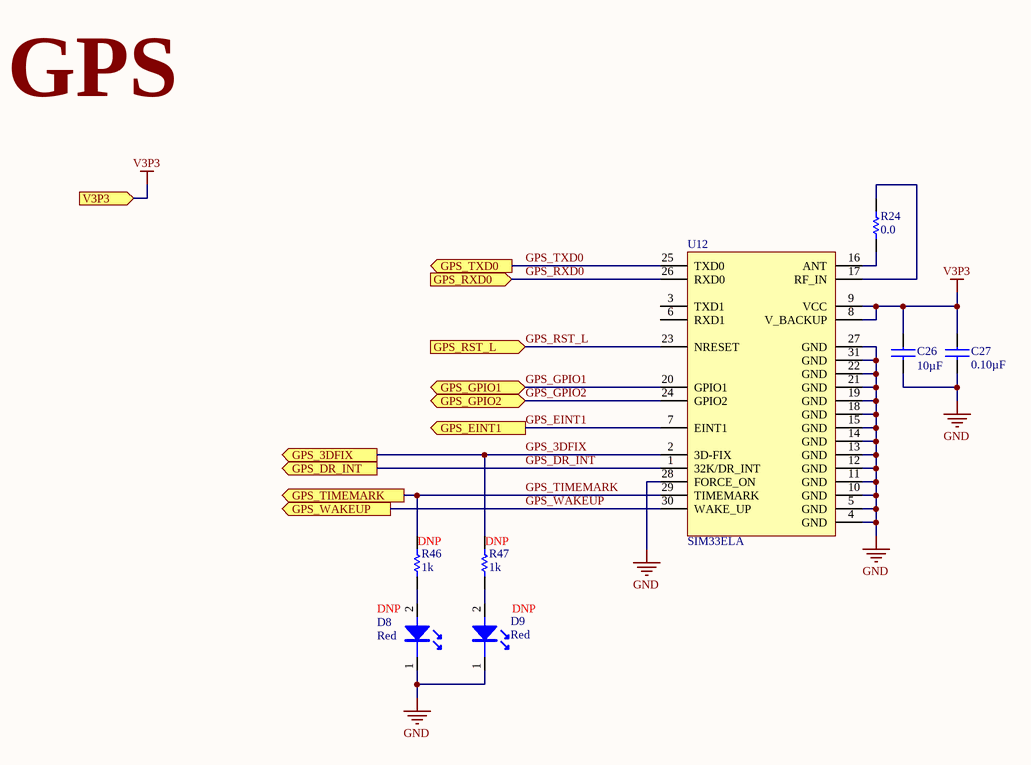
[diagram p9: gps_blk.SchDoc]

### Parts
C26  value 10µF  [C1206]  (hidden comment: GRM31CR71C106KAC7L)
C27  value 0.10µF  [C0402]  (hidden comment: GRM155R71H104ME14D)
D8  value Red  LOAD: DNP  [LED0402(RED)]  (hidden comment: VLMS1500-GS08)
D9  value Red  LOAD: DNP  [LED0402(RED)]  (hidden comment: VLMS1500-GS08)
R24  value 0.0  [R0603]  (hidden comment: CRCW06030000Z0EA)
R46  value 1k  LOAD: DNP  [R0402]  (hidden comment: ERJ-2RKF1001X)
R47  value 1k  LOAD: DNP  [R0402]  (hidden comment: ERJ-2RKF1001X)
U12  SIM33ELA  [SIM33ELA]

### Ports
GPS_3DFIX (out), GPS_DR_INT (out), GPS_EINT1 (out), GPS_GPIO1 (bidir), GPS_GPIO2 (bidir), GPS_RST_L (in), GPS_RXD0 (in), GPS_TIMEMARK (out), GPS_TXD0 (out), GPS_WAKEUP (out), V3P3 (in)

### Nets
GND: C26.2 C27.2 D8.1 D9.1 U12.4(GND) U12.5(GND) U12.10(GND) U12.11(GND) U12.12(GND) U12.13(GND) U12.14(GND) U12.15(GND) U12.18(GND) U12.19(GND) U12.21(GND) U12.22(GND) U12.27(GND) U12.28(FORCE_ON) U12.31(GND)
V3P3: C26.1 C27.1 U12.8(V_BACKUP) U12.9(VCC) ; port V3P3
GPS_3DFIX: R47.2 U12.2(3D-FIX) ; port GPS_3DFIX
GPS_DR_INT: U12.1(32K/DR_INT) ; port GPS_DR_INT
GPS_EINT1: U12.7(EINT1) ; port GPS_EINT1
GPS_GPIO1: U12.20(GPIO1) ; port GPS_GPIO1
GPS_GPIO2: U12.24(GPIO2) ; port GPS_GPIO2
GPS_RST_L: U12.23(NRESET) ; port GPS_RST_L
GPS_RXD0: U12.26(RXD0) ; port GPS_RXD0
GPS_TIMEMARK: R46.2 U12.29(TIMEMARK) ; port GPS_TIMEMARK
GPS_TXD0: U12.25(TXD0) ; port GPS_TXD0
GPS_WAKEUP: U12.30(WAKE_UP) ; port GPS_WAKEUP
NetD8_2: D8.2 R46.1
NetD9_2: D9.2 R47.1
NetR24_1: R24.1 U12.16(ANT)
NetR24_2: R24.2 U12.17(RF_IN)

Not connected (* = marked no-connect by the designer): U12 3(TXD1) 6(RXD1)

### Notes on the sheet
- GPS
- Title:
- Sheet:
- Date:
- of
- Project:
- Revision:
- Engineer:
- WI4B S.r.l

### Library data of the parts
C26 = GRM31CR71C106KAC7L: CAP CER 10UF 16V X7R 1206; MFT: Murata Electronics North America; TYPE: SMD; FUNCTION: gps; MPN: GRM31CR71C106KAC7L; RATING: 16V; DNP: *
C27 = GRM155R71H104ME14D: CAP CER 0.1UF 50V X7R 0402; MFT: Murata Electronics North America; TYPE: SMD; FUNCTION: gps; MPN: GRM155R71H104ME14D; RATING: 50V; DNP: *
D8 D9 = VLMS1500-GS08: LED RED 0402 SMD; ALT MPN1: YLS0402/R/21/05 C; MFT: Vishay Semiconductor Opto Division; ALT MFT1: Y.Lin Elect.; FUNCTION: gps; MPN: VLMS1500-GS08; TYPE: SMD; RATING: *; ALT DESC1: *
R24 = CRCW06030000Z0EA: RES SMD 0.0OHM JUMPER 1/10W 0603; MFT: Vishay Dale; RATING: 0.1W, 1/10W; FUNCTION: gps; MPN: CRCW06030000Z0EA; TYPE: Surface Mount
R46 R47 = ERJ-2RKF1001X: RES SMD 1K OHM 1% 1/10W 0402; MFT: Panasonic Electronic Components; RATING: 0.1W, 1/10W; FUNCTION: gps; MPN: ERJ-2RKF1001X; TYPE: Surface Mount; Parameter 1: *
U12 = SIM33ELA: A-GPS receiver, with built-in Antenna; ALT_MPN1: L96; MFT: SIMCom; ALT DESC1: RF TXRX MOD NAV INTEG/CHIP SMD; ALT MFT1: Quectel; FUNCTION: gps; VALUE: SIM33ELA; MPN: SIM33ELA

## Sheet switch_blk.SchDoc
size A4; Date: 1/11/16; Engineer: JBayalas; DocumentNumber: 12; Revision: V1.1; SheetNumber: 12; SheetTotal: 12
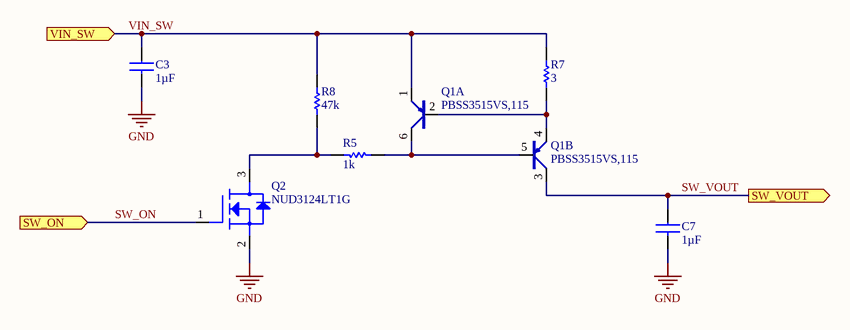
[diagram p10: switch_blk.SchDoc]

### Parts
C3  value 1µF  [C0603]  (hidden comment: EMK107B7105KA-T)
C7  value 1µF  [C0603]  (hidden comment: EMK107B7105KA-T)
Q1  PBSS3515VS,115  [SOT50P160X60-6N]  (parts A,B of 2)
Q2  NUD3124LT1G  [SOT-23-3]
R5  value 1k  [R0402]  (hidden comment: CRCW04021K00FKED)
R7  value 3  [R0402]  (hidden comment: RC0402FR-073RL)
R8  value 47k  [R0402]  (hidden comment: RC0402JR-0747KL)

### Ports
SW_ON (in), SW_VOUT (out), VIN_SW (in)

### Nets
GND: C3.2 C7.2 Q2.2(source)
SW_VOUT: C7.1 Q1.3(collector) ; port SW_VOUT  [project net V12P0_SW]
VIN_SW: C3.1 Q1.1(emitter) R7.2 R8.2 ; port VIN_SW  [project net V12P0]
SW_ON: Q2.1(gate) ; port SW_ON  [project net LSW_EN]
NetQ1_2: Q1.2(base) Q1.4(emitter) R7.1
NetQ1_5: Q1.5(base) Q1.6(collector) R5.2
NetQ2_3: Q2.3(drain) R5.1 R8.1

### Notes on the sheet
- Title:
- Sheet:
- Date:
- of
- Project:
- Revision:
- Engineer:
- Wi4B S.r.l

### Library data of the parts
C3 C7 = EMK107B7105KA-T: CAP CER 1UF 16V X7R 0603; MFT: Taiyo Yuden; TYPE: SMD; FUNCTION: Switch; MPN: EMK107B7105KA-T; RATING: 16V; LOAD: *
Q1 = PBSS3515VS,115: TRANS 2PNP 15V 0.5A SOT666; MFT: Nexperia USA Inc.; TYPE: SMD; FUNCTION: Switch; MPN: PBSS3515VS,115; LOAD: *; RATING: 15V; APN: *; VALUE: PBSS3515VS,115
Q2 = NUD3124LT1G: IC INDCT LOAD DRVR AUTO SOT23; MFT: ON Semiconductor; TYPE: Surface Mount; FUNCTION: Switch; VALUE: NUD3124LT1G; MPN: NUD3124LT1G
R5 = CRCW04021K00FKED: RES SMD 1K OHM 1% 1/16W 0402; MFT: Vishay Dale; RATING: 0.063W; APN: RQ-0013-R7-C; FUNCTION: Switch; MPN: CRCW04021K00FKED; TYPE: SMD
R7 = RC0402FR-073RL: RES 3 OHM 1% 1/16W 0402; MFT: YAGEO; FUNCTION: Switch; MPN: RC0402FR-073RL; TYPE: SMD; LOAD: *; RATING: 1/16W; APN: *
R8 = RC0402JR-0747KL: RES SMD 47K OHM 5% 1/16W 0402; MFT: Yageo; APN: RR-0473-R7-C; FUNCTION: Switch; MPN: RC0402JR-0747KL; LOAD: *; TYPE: SMD; RATING: 1/16W

## Sheet revision_history.SchDoc
size A4; Date: 10/27/2015; Engineer: JBayalas; DocumentNumber: 2; Revision: V4.3.0; SheetNumber: 2; SheetTotal: 12
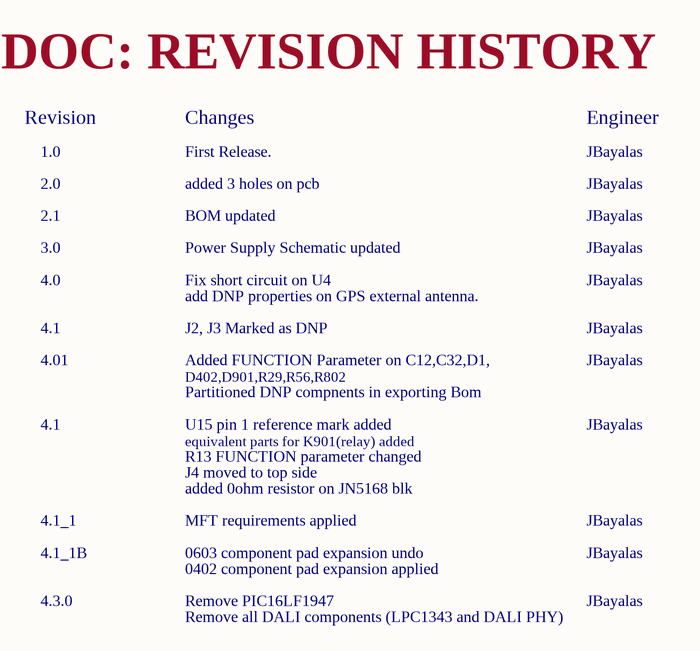
[diagram p11: revision_history.SchDoc]

### Notes on the sheet
- DOC: REVISION HISTORY
- Revision
- 1.0
- Changes
- First Release.
- Engineer
- JBayalas
- 2.0
- 2.1
- added 3 holes on pcb
- BOM updated
- 3.0
- 4.0
- Power Supply Schematic updated
- Fix short circuit on U4
- add DNP properties on GPS external antenna.
- 4.1
- 4.01
- J2, J3 Marked as DNP
- Added FUNCTION Parameter on C12,C32,D1,
- D402,D901,R29,R56,R802
- Partitioned DNP compnents in exporting Bom
- U15 pin 1 reference mark added
- equivalent parts for K901(relay) added
- R13 FUNCTION parameter changed
- J4 moved to top side
- 4.1_1
- 4.1_1B
- added 0ohm resistor on JN5168 blk
- MFT requirements applied
- 0603 component pad expansion undo
- 4.3.0
- 0402 component pad expansion applied
- Remove PIC16LF1947
- Remove all DALI components (LPC1343 and DALI PHY)
- Title:
- Sheet:
- Date:
- of
- Project:
- Revision:
- Engineer:
- Wi4B S.r.l

## Nets that join several sheets
GND: top_dsn (7 pins), power_supply_blk (11 pins), energy_meter_blk (C2.2 U10.3 U13.1), analog_inputs_blk (7 pins), analog_outputs_blk (5 pins), jn5168_blk (5 pins), relay_blk (C701.2 Q4.2 R1777.1), i2c_dev_blk (16 pins), gps_blk (19 pins), switch_blk (C3.2 C7.2 Q2.2)
LINE_IN: top_dsn (C101.2 P100.LINE V101.1), energy_meter_blk (23 pins)
V3P3: top_dsn (J3.1), power_supply_blk (5 pins), energy_meter_blk (5 pins), jn5168_blk (C209.1 L201.2 R201.2), i2c_dev_blk (14 pins), gps_blk (C26.1 C27.1 U12.8 U12.9)
V12P0: power_supply_blk (C404.1 D1.1 R6.2 U402.2), analog_inputs_blk (R48.1), analog_outputs_blk (C8.1 U2.5), relay_blk (D901.1 K901.4), switch_blk (C3.1 Q1.1 R7.2 R8.2)
V12P0_SW: top_dsn (P100.3), switch_blk (C7.1 Q1.3)
0_10V_CH1_OUT: top_dsn (P100.2), analog_inputs_blk (R605.1), analog_outputs_blk (D801.1 R806.2)
ADC0_IN: top_dsn (P100.4), analog_inputs_blk (D13.1 R601.1)
eMETER_LINE_OUT: power_supply_blk (U403.1), energy_meter_blk (R13.2 R16.1), relay_blk (K901.1)
GPS_RST_L: jn5168_blk (U201.4), gps_blk (U12.23)
GPS_RXD0: top_dsn (R10.2), gps_blk (U12.26)
GPS_TIMEMARK: jn5168_blk (U201.5), gps_blk (R46.2 U12.29)
GPS_TXD0: top_dsn (R9.2), gps_blk (U12.25)
I2C_JENIC_SCLK: top_dsn (J3.14), jn5168_blk (U201.25), i2c_dev_blk (5 pins)
I2C_JENIC_SDA: top_dsn (J3.12), jn5168_blk (U201.26), i2c_dev_blk (5 pins)
IRQ_I2C_DEV_L: jn5168_blk (R19.2), i2c_dev_blk (R41.2 R53.1 R54.2 R55.2)
JENIC_RXD1: top_dsn (R9.1 R30.2), jn5168_blk (U201.24)
JENIC_TXD1: top_dsn (J2.1 R10.1), jn5168_blk (U201.23)
JENNIC_RESET_L: top_dsn (J3.6), jn5168_blk (C203.1 R201.1 U201.22)
LINE_OUT: top_dsn (P100.LOAD), relay_blk (K901.5 V901.2)
LSW_EN: jn5168_blk (U201.20), switch_blk (Q2.1)
NetC28_1: analog_inputs_blk (C28.1 R48.2 R49.2), jn5168_blk (U201.7)
NetC601_1: analog_inputs_blk (C601.1 R601.2 R602.2), jn5168_blk (U201.1)
NetC603_1: analog_inputs_blk (C603.1 R605.2 R606.2), jn5168_blk (U201.6)
NetQ4_1: jn5168_blk (U201.10), relay_blk (Q4.1 R1777.2)
NetR1_2: top_dsn (R1.2), jn5168_blk (U201.16)
NetR50_2: top_dsn (R50.2), jn5168_blk (U201.14)
NetR105_2: top_dsn (R105.2), jn5168_blk (U201.15)
NetR108_1: analog_outputs_blk (R108.1), jn5168_blk (U201.19)
NetU1_2: energy_meter_blk (U1.2), jn5168_blk (U201.11)
NEUTRAL: top_dsn (F101.1 P100.NEUT), relay_blk (V901.1)
NEUTRAL_N: top_dsn (C101.1 F101.2 V101.2), power_supply_blk (U403.3), energy_meter_blk (R26.1)
PROG_L: top_dsn (J3.7), jn5168_blk (U201.3)
RXD0: top_dsn (J3.5), energy_meter_blk (R32.1 U10.4), jn5168_blk (U201.13)
TXD0: top_dsn (J3.3), energy_meter_blk (U9.2), jn5168_blk (U201.12)

## Assembly variants
Variant of WiLamp(Proto): not fitted B1 C7 C10 C11 C12 C13 C19 C20 D1 D2 D3 D4 D5 D10 D11 FB1 P7 P8 P104 P106 Q1 Q2 R19 R21 R22 R23 R24 R25 R26 R27 R28 R29 R38 R39 R40 R41 R42 R521 U3 U4 U5 U6 X1 X2